# EAGLE design Dashboard r5 (EAGLE 8.5.0)
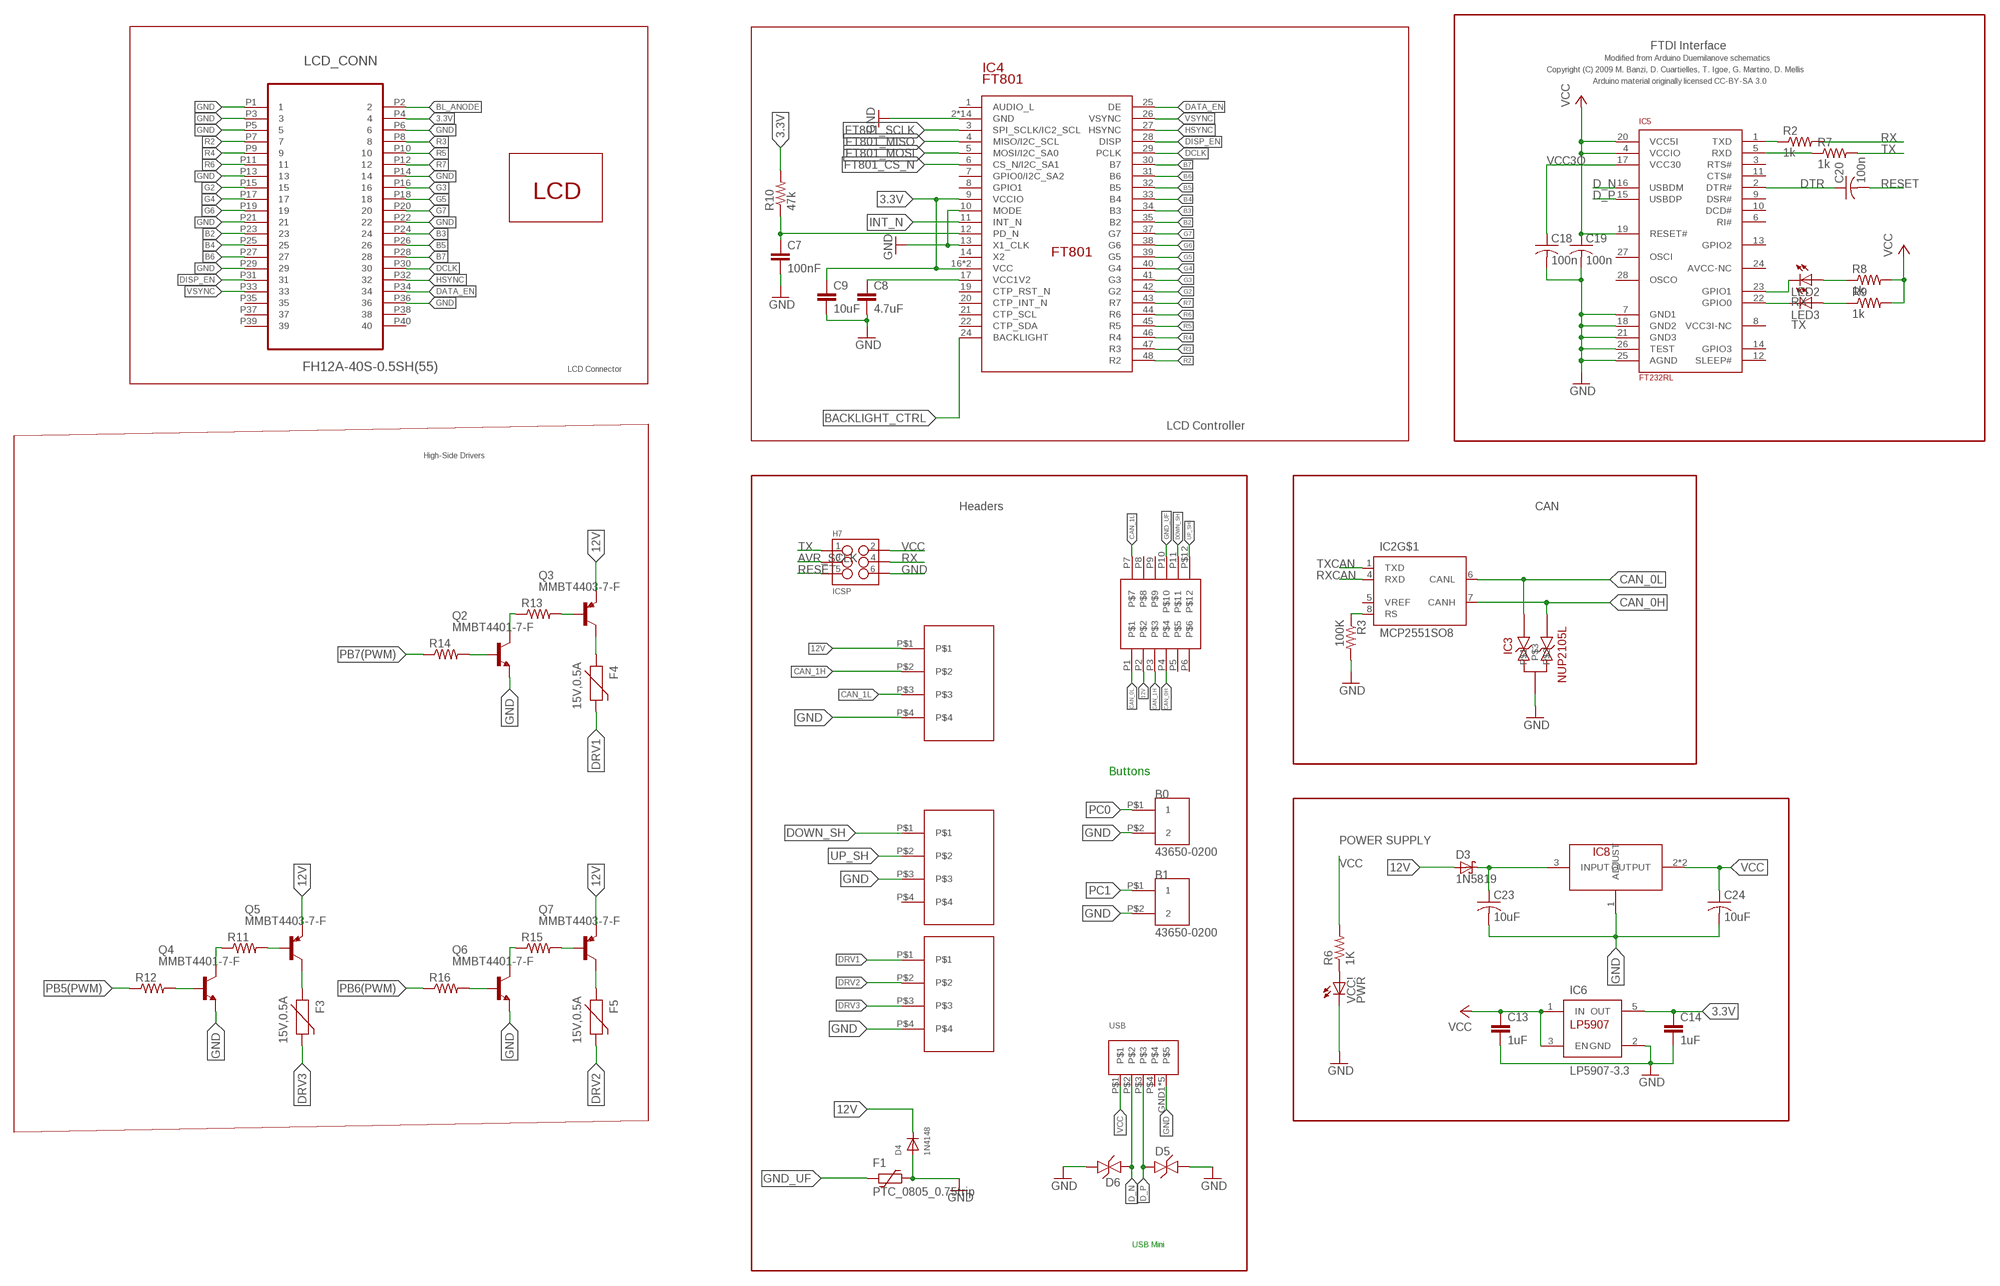
[diagram p0: schematic, sheet 1, part 1 of 2]
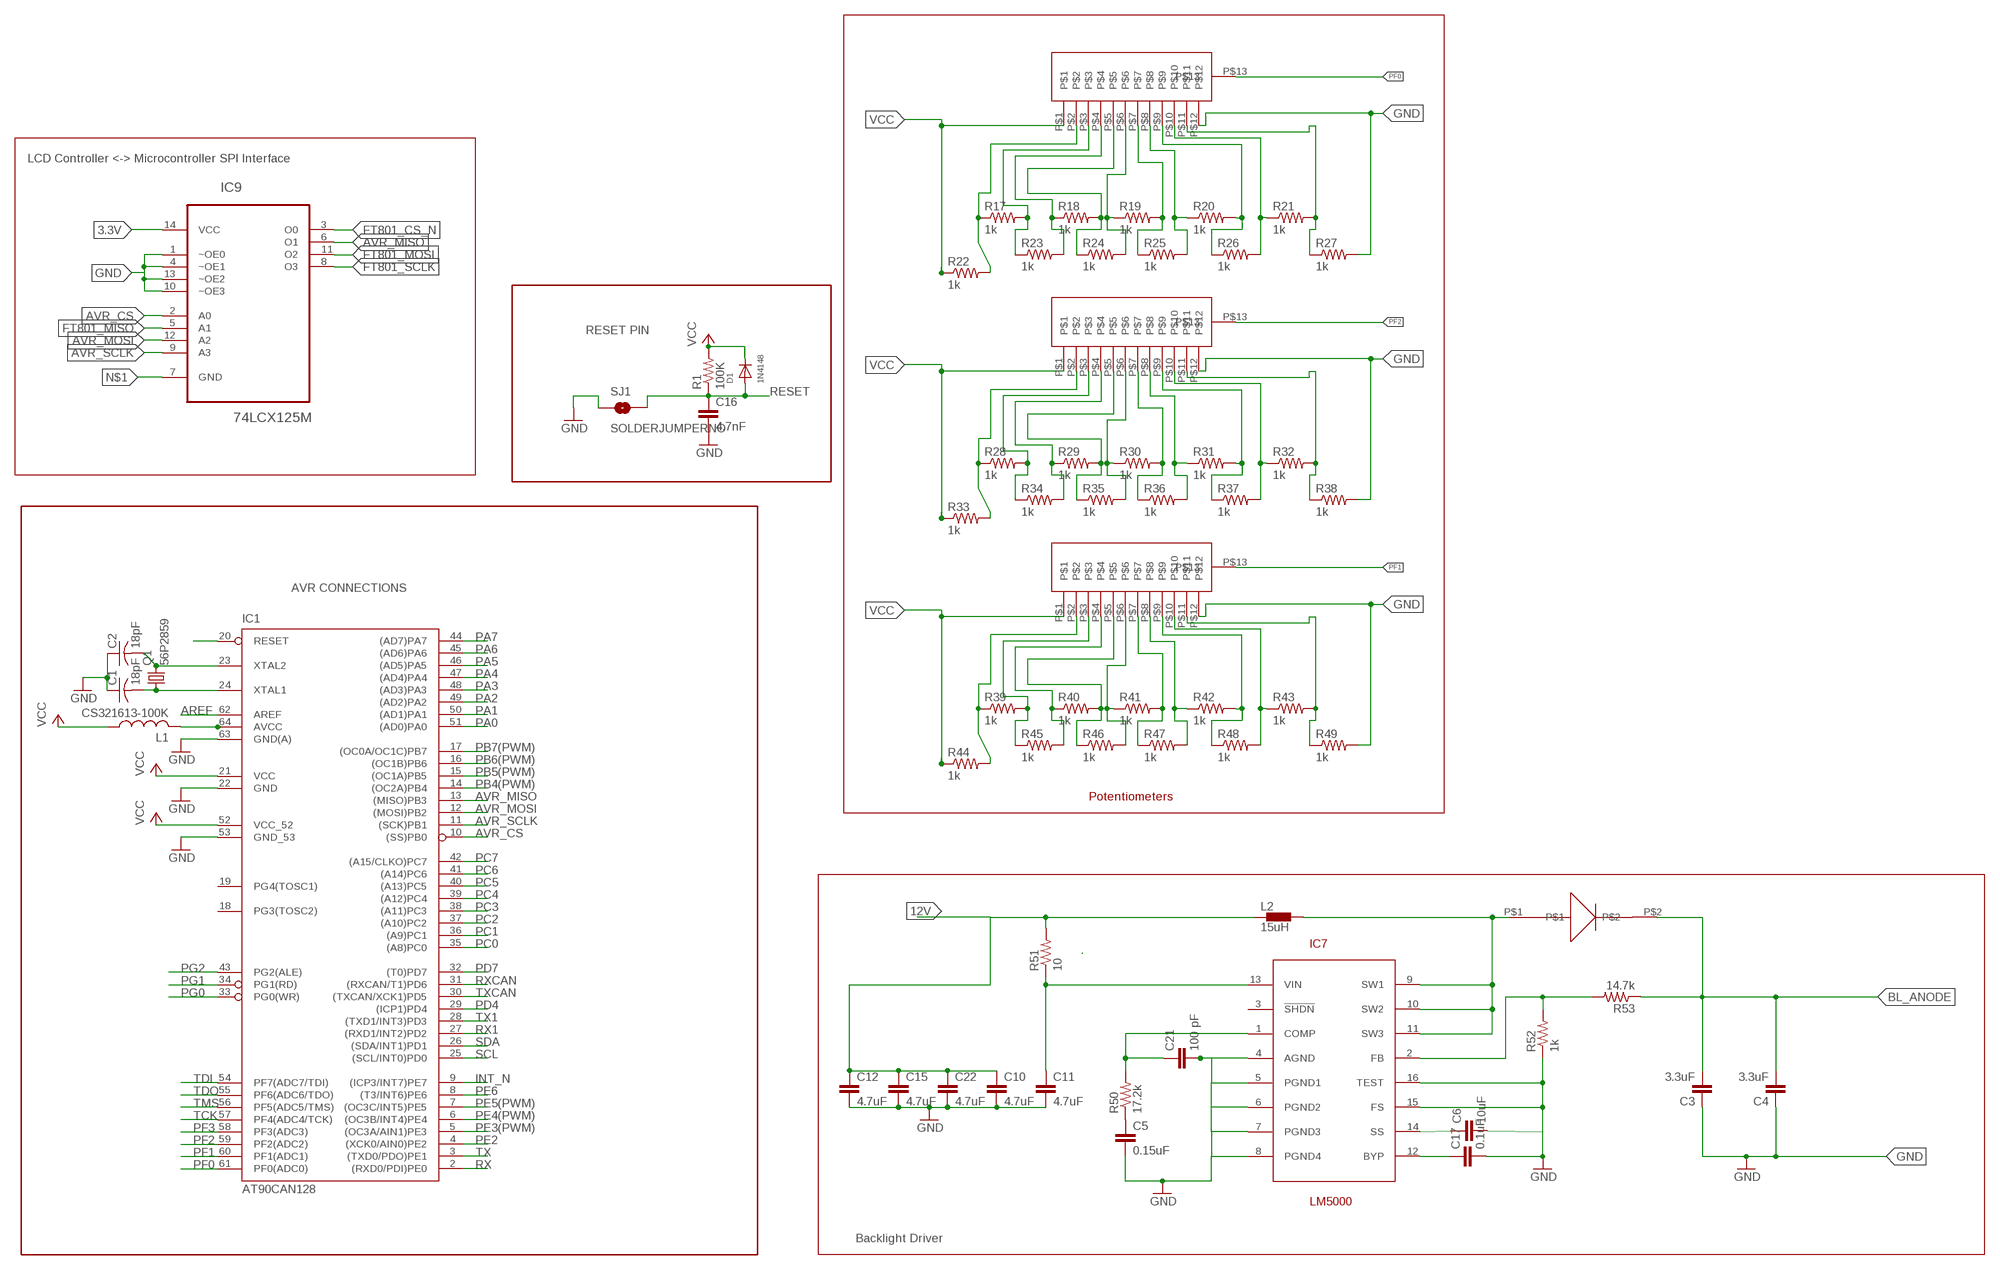
[diagram p1: schematic, sheet 1, part 2 of 2]

## Parts
B0  43650-0200  [MOLEX_43650-0200]
B1  43650-0200  [MOLEX_43650-0200]
C1  18pF  C-USC0805  [C0805]
C2  18pF  C-USC0805  [C0805]
C3  3.3uF  CAP0805  [0805]
C4  3.3uF  CAP0805  [0805]
C5  0.15uF  CAP0805  [0805]
C6  10uF  CAP0805  [0805]
C7  100nF  CAP0603-CAP  [0603-CAP]
C8  4.7uF  CAP0805  [0805]
C9  10uF  CAP0603-CAP  [0603-CAP]
C10  4.7uF  CAP0805  [0805]
C11  4.7uF  CAP0805  [0805]
C12  4.7uF  CAP0805  [0805]
C13  1uF  CAP0603-CAP  [0603-CAP]
C14  1uF  CAP0603-CAP  [0603-CAP]
C15  4.7uF  CAP0805  [0805]
C16  4.7nF  CAP0805  [0805]
C17  0.1uF  CAP0805  [0805]
C18  100n  C-USC0805  [C0805]
C19  100n  C-USC0805  [C0805]
C20  100n  C-USC0805  [C0805]
C21  100 pF  CAP0805  [0805]
C22  4.7uF  CAP0805  [0805]
C23  10uF  C-USC0603  [C0603]
C24  10uF  C-USC0603  [C0603]
CAN1  043650-0409  [043650-0409]
D1  1N4148  DIODESOD-123  [SOD-123]
D2  B160-FDICT_NB  [B160-FDICT-NB]
D3  1N5819  1N5819-BSOD123  [SOD123]
D4  1N4148  DIODESOD-123  [SOD-123]
D5  24VM, 150VC, 0603  TVS_24VM-150VC-0603  [0603]
D6  24VM, 150VC, 0603  TVS_24VM-150VC-0603  [0603]
F1  PTC_0805_0.75trip  PTC_FUSE010/240805L  [0805L]
F3  15V,0.5A  PTCSMD  [PTC-1206]
F4  15V,0.5A  PTCSMD  [PTC-1206]
F5  15V,0.5A  PTCSMD  [PTC-1206]
H7  ICSP  M03X2SMD_FCI  [2X3_SMD_FCI_54202-G30]
IC1  AT90CAN128  [TQFP64]
IC2  MCP2551SO8  [SO08]
IC3  NUP2105L  [SOT-23]
IC4  FT801  [RGZ48_5P15X5P15]
IC5  FT232RL  [SSOP28]
IC6  LP5907-3.3  LP5907  [SOT23-DBV]
IC7  LM5000  [LM5000]
IC8  NCP1117  [SOT-223-4]
IC9  74LCX125M  [SOIC127P600X175-14N]
J2  HR30-7R-12PD(71)  [HR30-7R-12PD(71)]
L1  CS321613-100K  L-USL3216C  [L3216C]
L2  15uH  DEM8045C  [DEM8045C]
LCD  TCG043WQLBAANN-GN00  [TCG043WQLBAANN]
LCD_CONN  FH12A-40S-0.5SH(55)  [HIROSE_FH12A-40S-0.5SH(55)]
LED  043650-0409  [043650-0409]
LED2  RX  LEDCHIPLED_0805  [CHIPLED_0805]
LED3  TX  LEDCHIPLED_0805  [CHIPLED_0805]
Q1  56P2859  CRYSTALSMD  [HC49UP]
Q2  MMBT4401-7-F  [SOT-23-3]
Q3  MMBT4403-7-F  [SOT-23-3]
Q4  MMBT4401-7-F  [SOT-23-3]
Q5  MMBT4403-7-F  [SOT-23-3]
Q6  MMBT4401-7-F  [SOT-23-3]
Q7  MMBT4403-7-F  [SOT-23-3]
R1  100K  R-US_R0805  [R0805]
R2  1k  R-US_R0805  [R0805]
R3  100K  R-US_R0805  [R0805]
R6  1K  R-US_R0805  [R0805]
R7  1k  R-US_R0805  [R0805]
R8  1k  R-US_R0805  [R0805]
R9  1k  R-US_R0805  [R0805]
R10  47k  RESISTOR0603  [0603-RES]
R11  RESISTOR0603  [0603-RES]
R12  RESISTOR0603  [0603-RES]
R13  RESISTOR0603  [0603-RES]
R14  RESISTOR0603  [0603-RES]
R15  RESISTOR0603  [0603-RES]
R16  RESISTOR0603  [0603-RES]
R17  1k  R-US_R0603  [R0603]
R18  1k  R-US_R0603  [R0603]
R19  1k  R-US_R0603  [R0603]
R20  1k  R-US_R0603  [R0603]
R21  1k  R-US_R0603  [R0603]
R22  1k  R-US_R0603  [R0603]
R23  1k  R-US_R0603  [R0603]
R24  1k  R-US_R0603  [R0603]
R25  1k  R-US_R0603  [R0603]
R26  1k  R-US_R0603  [R0603]
R27  1k  R-US_R0603  [R0603]
R28  1k  R-US_R0603  [R0603]
R29  1k  R-US_R0603  [R0603]
R30  1k  R-US_R0603  [R0603]
R31  1k  R-US_R0603  [R0603]
R32  1k  R-US_R0603  [R0603]
R33  1k  R-US_R0603  [R0603]
R34  1k  R-US_R0603  [R0603]
R35  1k  R-US_R0603  [R0603]
R36  1k  R-US_R0603  [R0603]
R37  1k  R-US_R0603  [R0603]
R38  1k  R-US_R0603  [R0603]
R39  1k  R-US_R0603  [R0603]
R40  1k  R-US_R0603  [R0603]
R41  1k  R-US_R0603  [R0603]
R42  1k  R-US_R0603  [R0603]
R43  1k  R-US_R0603  [R0603]
R44  1k  R-US_R0603  [R0603]
R45  1k  R-US_R0603  [R0603]
R46  1k  R-US_R0603  [R0603]
R47  1k  R-US_R0603  [R0603]
R48  1k  R-US_R0603  [R0603]
R49  1k  R-US_R0603  [R0603]
R50  17.2k  RESISTOR0805-RES  [0805]
R51  10  RESISTOR0603  [0603-RES]
R52  1k  RESISTOR0603  [0603-RES]
R53  14.7k  RESISTOR0603  [0603-RES]
S1  ROTSWITCH  [ROTSWITCH]
S2  ROTSWITCH  [ROTSWITCH]
S3  ROTSWITCH  [ROTSWITCH]
SHIFT  043650-0409  [043650-0409]
SJ1  SOLDERJUMPERNO  [SJ_2S-NO]
USB  67503-1020  [MOLEX_67503-1020]
VCC!  PWR  LEDCHIPLED_0805  [CHIPLED_0805]

## Nets
3.3V: C9.1 C14.1 IC4.9(VCCIO) IC4.16(VCC) IC4.18(VCC) IC6.5(OUT) IC9.14(VCC) LCD_CONN.P4 R10.2
5V_REG_IN: C23.1 D3.C IC8.3(INPUT)
12V [Class2]: C10.1 C12.1 C15.1 C22.1 CAN1.P$1 D3.A D4.C J2.P2 L2.P$1 Q3.P$3(E) Q5.P$3(E) Q7.P$3(E) R51.2
AREF: IC1.62(AREF)
AVR_CS: IC1.10((SS)PB0) IC9.2(A0)
AVR_MISO: IC1.13((MISO)PB3) IC9.6(O1)
AVR_MOSI: IC1.12((MOSI)PB2) IC9.12(A2)
AVR_SCLK: H7.3 IC1.11((SCK)PB1) IC9.9(A3)
B2: IC4.35(B2) LCD_CONN.P23
B3: IC4.34(B3) LCD_CONN.P24
B4: IC4.33(B4) LCD_CONN.P25
B5: IC4.32(B5) LCD_CONN.P26
B6: IC4.31(B6) LCD_CONN.P27
B7: IC4.30(B7) LCD_CONN.P28
BACKLIGHT_CTRL: IC4.24(BACKLIGHT)
BL_ANODE [USB]: C3.2 C4.2 D2.P$2 LCD_CONN.P2 R53.1
CAN_0H [USB]: IC2.7(CANH) IC3.2 J2.P4
CAN_0L [USB]: IC2.6(CANL) IC3.1 J2.P1
CAN_1H: CAN1.P$2 J2.P3
CAN_1L: CAN1.P$3 J2.P7
D_N [USB]: D6.1 IC5.16(USBDM) USB.P$2
D_P [USB]: D5.1 IC5.15(USBDP) USB.P$3
DATA_EN: IC4.25(DE) LCD_CONN.P34
DCLK: IC4.29(PCLK) LCD_CONN.P30
DISP_EN: IC4.28(DISP) LCD_CONN.P31
DOWN_SH: J2.P11 SHIFT.P$1
DRV1 [Class3]: F4.2 LED.P$1
DRV2 [Class3]: F5.2 LED.P$2
DRV3 [Class3]: F3.2 LED.P$3
DTR: C20.1 IC5.2(DTR#)
FT801_CS_N: IC4.6(CS_N/I2C_SA1) IC9.3(O0)
FT801_MISO: IC4.4(MISO/I2C_SCL) IC9.5(A1)
FT801_MOSI: IC4.5(MOSI/I2C_SA0) IC9.11(O2)
FT801_SCLK: IC4.3(SPI_SCLK/IC2_SCL) IC9.8(O3)
G2: IC4.42(G2) LCD_CONN.P15
G3: IC4.41(G3) LCD_CONN.P16
G4: IC4.40(G4) LCD_CONN.P17
G5: IC4.39(G5) LCD_CONN.P18
G6: IC4.38(G6) LCD_CONN.P19
G7: IC4.37(G7) LCD_CONN.P20
GND [GND]: B0.P$2 B1.P$2 C1.1 C2.1 C3.1 C4.1 C5.2 C6.2 C7.2 C8.2 C9.2 C10.2 C11.2 C12.2 C13.2 C14.2 C15.2 C16.2 C17.2 C18.2 C19.2 C21.2 C22.2 C23.2 C24.2 CAN1.P$4 D4.A D5.2 D6.2 F1.1 H7.6 IC1.22(GND) IC1.53(GND_53) IC1.63(GND(A)) IC3.3 IC4.2(GND) IC4.10(MODE) IC4.13(X1_CLK) IC4.15(GND) IC4.23(GND) IC4.36(GND) IC4.EP(GND) IC4.V_1(GND) IC4.V_2(GND) IC4.V_3(GND) IC4.V_4(GND) IC4.V_5(GND) IC4.V_6(GND) IC4.V_7(GND) IC4.V_8(GND) IC4.V_9(GND) IC5.7(GND1) IC5.18(GND2) IC5.21(GND3) IC5.25(AGND) IC5.26(TEST) IC6.2(GND) IC7.4(AGND) IC7.5(PGND1) IC7.6(PGND2) IC7.7(PGND3) IC7.8(PGND4) IC7.15(FS) IC7.16(TEST) IC8.1(ADJUST) IC9.1(~OE0) IC9.4(~OE1) IC9.10(~OE3) IC9.13(~OE2) LCD_CONN.P1 LCD_CONN.P3 LCD_CONN.P5 LCD_CONN.P6 LCD_CONN.P13 LCD_CONN.P14 LCD_CONN.P21 LCD_CONN.P22 LCD_CONN.P29 LCD_CONN.P36 LED.P$4 Q2.P$3(E) Q4.P$3(E) Q6.P$3(E) R3.2 R27.2 R38.2 R49.2 R52.1 S1.P$12 S2.P$12 S3.P$12 SHIFT.P$3 SJ1.1 USB.GND1 USB.GND2 USB.GND3 USB.GND4 USB.P$5 VCC!.C
GND_UF: F1.2 J2.P10
HSYNC: IC4.27(HSYNC) LCD_CONN.P32
INT_N: IC1.9((ICP3/INT7)PE7) IC4.11(INT_N)
M8RXD: IC5.1(TXD) R2.1
M8TXD: IC5.5(RXD) R7.1
N$1 [Class2]: IC9.7(GND)
N$2: C8.1 IC4.17(VCC1V2)
N$3: C7.1 IC4.12(PD_N) R10.1
N$4: C5.1 R50.1
N$6: IC2.8(RS) R3.1
N$9: R6.1 VCC!.A
N$11: C1.2 IC1.24(XTAL1) Q1.1
N$22: IC1.64(AVCC) L1.2
N$27 [Class3]: Q4.P$2(B) R12.2
N$28 [Class3]: Q5.P$2(B) R11.2
N$29 [Class3]: Q4.P$1(C) R11.1
N$30 [Class3]: F3.1 Q5.P$1(C)
N$31 [Class3]: Q2.P$2(B) R14.2
N$32: IC5.23(GPIO1) LED2.C
N$33 [Class3]: Q3.P$2(B) R13.2
N$34: IC5.22(GPIO0) LED3.C
N$35: LED2.A R8.1
N$36: LED3.A R9.1
N$37 [Class3]: Q2.P$1(C) R13.1
N$38 [Class3]: F4.1 Q3.P$1(C)
N$39 [Class3]: Q6.P$2(B) R16.2
N$40 [Class3]: Q7.P$2(B) R15.2
N$41 [Class3]: Q6.P$1(C) R15.1
N$42 [Class3]: F5.1 Q7.P$1(C)
N$43: R17.1 R22.2 S1.P$2
N$44: R17.2 R23.1 S1.P$3
N$45: R18.1 R23.2 S1.P$4
N$46: R18.2 R24.1 S1.P$5
N$47: R20.1 R25.2 S1.P$8
N$48: R20.2 R26.1 S1.P$9
N$49: R19.1 R24.2 S1.P$6
N$50: R19.2 R25.1 S1.P$7
N$51: R21.1 R26.2 S1.P$10
N$52: R28.1 R33.2 S2.P$2
N$53: R21.2 R27.1 S1.P$11
N$54: R28.2 R34.1 S2.P$3
N$55: R29.1 R34.2 S2.P$4
N$56: R29.2 R35.1 S2.P$5
N$57: R31.1 R36.2 S2.P$8
N$58: R31.2 R37.1 S2.P$9
N$59: R30.1 R35.2 S2.P$6
N$60: R30.2 R36.1 S2.P$7
N$61: R32.1 R37.2 S2.P$10
N$62: R32.2 R38.1 S2.P$11
N$63: R39.1 R44.2 S3.P$2
N$64: R39.2 R45.1 S3.P$3
N$65: R40.1 R45.2 S3.P$4
N$66: R40.2 R46.1 S3.P$5
N$67: R42.1 R47.2 S3.P$8
N$68: R42.2 R48.1 S3.P$9
N$69: R41.1 R46.2 S3.P$6
N$70: R41.2 R47.1 S3.P$7
N$71: R43.1 R48.2 S3.P$10
N$72: R43.2 R49.1 S3.P$11
N$75: C21.1 IC7.1(COMP) R50.2
N$77: C11.1 IC7.13(VIN) R51.1
N$79: D2.P$1 IC7.9(SW1) IC7.10(SW2) IC7.11(SW3) L2.P$2
N$82: IC7.2(FB) R52.2 R53.2
N$85: C6.1 IC7.14(SS)
N$87: C17.1 IC7.12(BYP)
PA0: IC1.51((AD0)PA0)
PA1: IC1.50((AD1)PA1)
PA2: IC1.49((AD2)PA2)
PA3: IC1.48((AD3)PA3)
PA4: IC1.47((AD4)PA4)
PA5: IC1.46((AD5)PA5)
PA6: IC1.45((AD6)PA6)
PA7: IC1.44((AD7)PA7)
PB4(PWM): IC1.14((OC2A)PB4)
PB5(PWM): IC1.15((OC1A)PB5) R12.1
PB6(PWM): IC1.16((OC1B)PB6) R16.1
PB7(PWM): IC1.17((OC0A/OC1C)PB7) R14.1
PC0: B0.P$1 IC1.35((A8)PC0)
PC1: B1.P$1 IC1.36((A9)PC1)
PC2: IC1.37((A10)PC2)
PC3: IC1.38((A11)PC3)
PC4: IC1.39((A12)PC4)
PC5: IC1.40((A13)PC5)
PC6: IC1.41((A14)PC6)
PC7: IC1.42((A15/CLKO)PC7)
PD4: IC1.29((ICP1)PD4)
PD7: IC1.32((T0)PD7)
PE2: IC1.4((XCK0/AIN0)PE2)
PE3(PWM): IC1.5((OC3A/AIN1)PE3)
PE4(PWM): IC1.6((OC3B/INT4)PE4)
PE5(PWM): IC1.7((OC3C/INT5)PE5)
PE6: IC1.8((T3/INT6)PE6)
PF0: IC1.61(PF0(ADC0)) S1.P$13
PF1: IC1.60(PF1(ADC1)) S3.P$13
PF2: IC1.59(PF2(ADC2)) S2.P$13
PF3: IC1.58(PF3(ADC3))
PG0: IC1.33(PG0(WR))
PG1: IC1.34(PG1(RD))
PG2: IC1.43(PG2(ALE))
R2: IC4.48(R2) LCD_CONN.P7
R3: IC4.47(R3) LCD_CONN.P8
R4: IC4.46(R4) LCD_CONN.P9
R5: IC4.45(R5) LCD_CONN.P10
R6: IC4.44(R6) LCD_CONN.P11
R7: IC4.43(R7) LCD_CONN.P12
RESET [USB]: C16.1 C20.2 D1.A H7.5 IC1.20(RESET) R1.1 SJ1.2
RX: H7.4 IC1.2((RXD0/PDI)PE0) R2.2
RX1: IC1.27((RXD1/INT2)PD2)
RXCAN: IC1.31((RXCAN/T1)PD6) IC2.4(RXD)
SCL: IC1.25((SCL/INT0)PD0)
SDA: IC1.26((SDA/INT1)PD1)
TCK: IC1.57(PF4(ADC4/TCK))
TDI: IC1.54(PF7(ADC7/TDI))
TDO: IC1.55(PF6(ADC6/TDO))
TMS: IC1.56(PF5(ADC5/TMS))
TX: H7.1 IC1.3((TXD0/PDO)PE1) R7.2
TX1: IC1.28((TXD1/INT3)PD3)
TXCAN: IC1.30((TXCAN/XCK1)PD5) IC2.1(TXD)
UP_SH [GND]: J2.P$12 SHIFT.P$2
VCC [USB]: C13.1 C19.1 C24.1 D1.C H7.2 IC1.21(VCC) IC1.52(VCC_52) IC5.4(VCCIO) IC5.19(RESET#) IC5.20(VCC5I) IC6.1(IN) IC6.3(EN) IC8.2(OUTPUT) IC8.4(OUTPUT) L1.1 R1.2 R6.2 R8.2 R9.2 R22.1 R33.1 R44.1 S1.P$1 S2.P$1 S3.P$1 USB.P$1
VCC3O: C18.1 IC5.17(VCC30)
VSYNC: IC4.26(VSYNC) LCD_CONN.P33
XTAL1: C2.2 IC1.23(XTAL2) Q1.2
Unconnected: IC1.18(PG3(TOSC2)) IC1.19(PG4(TOSC1)) IC2.5(VREF) IC4.1(AUDIO_L) IC4.7(GPIO0/I2C_SA2) IC4.8(GPIO1) IC4.14(X2) IC4.19(CTP_RST_N) IC4.20(CTP_INT_N) IC4.21(CTP_SCL) IC4.22(CTP_SDA) IC5.3(RTS#) IC5.6(RI#) IC5.8(VCC3I-NC) IC5.9(DSR#) IC5.10(DCD#) IC5.11(CTS#) IC5.12(SLEEP#) IC5.13(GPIO2) IC5.14(GPIO3) IC5.24(AVCC-NC) IC5.27(OSCI) IC5.28(OSCO) IC7.3(!SHDN) J2.P5 J2.P6 J2.P8 J2.P9 LCD_CONN.P35 LCD_CONN.P37 LCD_CONN.P38 LCD_CONN.P39 LCD_CONN.P40 SHIFT.P$4 USB.P$4

## Notes on the sheet
- LCD Controller <-> Microcontroller SPI Interface
- FTDI Interface
- Modified from Arduino Duemilanove schematics
- Copyright (C) 2009 M. Banzi, D. Cuartielles, T. Igoe, G. Martino, D. Mellis
- Arduino material originally licensed CC-BY-SA 3.0
- RESET PIN
- AVR CONNECTIONS
- LCD Connector
- LCD Controller
- High-Side Drivers
- Headers | CAN
- Potentiometers
- Buttons
- POWER SUPPLY
- Backlight Driver
- USB Mini

## Power pins joined to a net without a drawn wire
GND: IC2.2(GND)
VCC: IC2.3(VCC)

## Library data of the parts
B0 B1 = molex:43650-0200
C1 C2 C18-C20 = rcl:C-US: CAPACITOR, American symbol; SPICEPREFIX: C
C3-C8 C10-C17 C21 C22 = SparkFun-Capacitors:CAP: Capacitor Standard 0603 ceramic capacitor, and 0.1" leaded capacitor.
C9 = SparkFun-Passives:CAP: Capacitor Standard 0603 ceramic capacitor, and 0.1" leaded capacitor.
C23 C24 = rcl:C-US: CAPACITOR, American symbol
CAN1 LED SHIFT = molex:043650-0409
D1 D4 = adafruit:DIODE: Diode SMADIODE - SMA Surface Mount Package 20V 1A Schottky Diode Digikey: 641-1014-6-ND DO-1N4148 - Through Hole Small Current Diode SOD-123 20V 1 A (.5mV Vf) Schottky Diode - Digikey: MBRX120TPMSCT-ND SOD-323 10V 570mA (.38mV Vf, 3ns) Schottky Diode - Digikey: ZLLS410CT-ND SOD-523 30V 30mA Schottky Diode (RB751S-40TE61) - Digikey: RB751S-40TE61CT-ND SOT23-R/W - SOT23 Package (R = Solder Paste/Reflow Ovens, W = Hand-Soldering) BAT54Film 40V 300mA - Digikey: 497-7162-1-ND
D2 = diodes-inc-e14:B160-FDICT_NB
D3 = diode:1N581*: 1.0A SCHOTTKY BARRIER RECTIFIER Source: http://www.diodes.com/datasheets/ds23001.pdf
D5 D6 = texas-boosterpack:TVS_; CCO: 130-0001371; DESCRIPTION: TVS DIODE 24VWM 150VC 0603; MAN: LITTLEFUSE
F1 = LittleFuse:PTC_FUSE: Polyfuse Resettable PTC Source: http://www.littelfuse.com/products/resettable-ptcs.aspx; MF: Littelfuse; MPN: 0805L010/24; OC_FARNELL: unknown; OC_NEWARK: 23X4297
F3-F5 = SparkFun:PTC: Resettable Fuse PTC Resettable Fuse. Spark Fun Electronics SKU : COM-08357
H7 = SparkFun-Connectors:M03X2: 2x3 .1" header. Shrouded, with keying- CONN-10681 SMT- CONN-11415 Pogo pins- HW-11044
IC1 = at90can128:AT90CAN128
IC2 = can:MCP2551: CAN Tranceiver Microchip
IC3 = Artificial Science:NUP2105L
IC4 = ftdichip:FT801: IC TFT LCD CONTROLLER 48VQFN
IC5 = SmartPrj:FT232RL
IC6 = texas:LP5907
IC7 = texas:LM5000
IC8 = on-semiconductor:NCP1117
IC9 = Fairchild_By_element14_Batch_1:74LCX125M: Low Voltage Quad Buffer with 5V Tolerant Inputs and Outputs; MPN: 74LCX125M; OC_FARNELL: 1013776; OC_NEWARK: 78K6286; PACKAGE: SOIC-14; SUPPLIER: Fairchild
J2 = hisense:HR30-7R-12PD(71)
L1 = rcl:L-US: INDUCTOR, American symbol; SPICEPREFIX: L
L2 = inductors:DEM8045C
LCD = kyocera:TCG043WQLBAANN-GN00
LCD_CONN = hirose:FH12A-40S-0.5SH(55): SOCKET FFC/FPC, ZIF, 0.5MM, 40WAY; MPN: FH12A-40S-0.5SH(55); OC_FARNELL: 1324569; OC_NEWARK: 34M6194; PACKAGE: SOCKET FFC/FPC, ZIF, 0.5MM, 40WAY; SUPPLIER: Hirose
LED2 LED3 VCC! = led:LED: LED OSRAM: - CHIPLED LG R971, LG N971, LY N971, LG Q971, LY Q971, LO R971, LY R971 LH N974, LH R974 LS Q976, LO Q976, LY Q976 LO Q996 - Hyper CHIPLED LW Q18S LB Q993, LB Q99A, LB R99A - SideLED LS A670, LO A670, LY A670, LG A670, LP A670 LB A673, LV A673, LT A673, LW A673 LH A674 LY A675 LS A676, LA A676, LO A676, LY A676, LW A676 LS A679, LY A679, LG A679 - Hyper Micro SIDELED® LS Y876, LA Y876, LO Y876, LY Y876 LT Y87S - SmartLED LW L88C, LW L88S LB L89C, LB L89S, LG L890 LS L89K, LO L89K, LY L89K LS L896, LA L896, LO L896, LY L896 - TOPLED LS T670, LO T670, LY T670, LG T670, LP T670 LSG T670, LSP T670, LSY T670, LOP T670, LYG T670 LG T671, LOG T671, LSG T671 LB T673, LV T673, LT T673, LW T673 LH T674 LS T676, LA T676, LO T676, LY T676, LB T676, LH T676, LSB T676, LW T676 LB T67C, LV T67C, LT T67C, LS T67K, LO T67K, LY T67K, LW E67C LS E67B, LA E67B, LO E67B, LY E67B, LB E67C, LV E67C, LT E67C LW T67C LS T679, LY T679, LG T679 LS T770, LO T770, LY T770, LG T770, LP T770 LB T773, LV T773, LT T773, LW T773 LH T774 LS E675, LA E675, LY E675, LS T675 LS T776, LA T776, LO T776, LY T776, LB T776 LHGB T686 LT T68C, LB T68C - Hyper Mini TOPLED® LB M676 - Mini TOPLED Santana® LG M470 LS M47K, LO M47K, LY M47K Source: http://www.osram.convergy.de LUXEON: - LUMILED® LXK2-PW12-R00, LXK2-PW12-S00, LXK2-PW14-U00, LXK2-PW14-V00 LXK2-PM12-R00, LXK2-PM12-S00, LXK2-PM14-U00 LXK2-PE12-Q00, LXK2-PE12-R00, LXK2-PE12-S00, LXK2-PE14-T00, LXK2-PE14-U00 LXK2-PB12-K00, LXK2-PB12-L00, LXK2-PB12-M00, LXK2-PB14-N00, LXK2-PB14-P00, LXK2-PB14-Q00 LXK2-PR12-L00, LXK2-PR12-M00, LXK2-PR14-Q00, LXK2-PR14-R00 LXK2-PD12-Q00, LXK2-PD12-R00, LXK2-PD12-S00 LXK2-PH12-R00, LXK2-PH12-S00 LXK2-PL12-P00, LXK2-PL12-Q00, LXK2-PL12-R00 Source: www.luxeon.com KINGBRIGHT: KA-3528ASYC Source: www.kingbright.com
Q1 = SparkFun-FreqCtrl:CRYSTAL: Various standard crystals. Proven footprints. Spark Fun Electronics SKU : COM-00534
Q2 Q4 Q6 = formula electric:MMBT4401-7-F
Q3 Q5 Q7 = formula electric:MMBT4403-7-F
R1-R3 R6-R9 = rcl:R-US_: RESISTOR, American symbol; SPICEPREFIX: R
R10-R16 R51-R53 = SparkFun-Resistors:RESISTOR: Resistor Basic schematic elements and footprints for 0603, 1206, and PTH resistors.
R17-R49 = rcl:R-US_: RESISTOR, American symbol
R50 = SparkFun-Passives:RESISTOR: Resistor Basic schematic elements and footprints for 0603, 1206, and PTH resistors.
S1-S3 = DashAndCAN library:ROTSWITCH
SJ1 = SparkFun-Passives:SOLDERJUMPER: Solder Jumper Standard SMD solder jumper. Used to automate production. Two varients : Normally Open and Normally Closed are the same, but have different paste layers. NC will have a large amount of paste and should jumper during reflow.
USB = molex:67503-1020: USB On-The-Go (OTG) Mini-B Receptacle, Surface Mount, Right Angle, Solder Tabs with Back Cover and PCB Locator Plastic Pegs, Lead-Free

## Net classes
1 USB: width 0.366 mm, clearance 0.152 mm to class 0, clearance 0.152 mm
2 Class2: width 0.635 mm, clearance 0.178 mm
3 Class3: width 0.559 mm
4 GND: width 0.406 mm

## Board
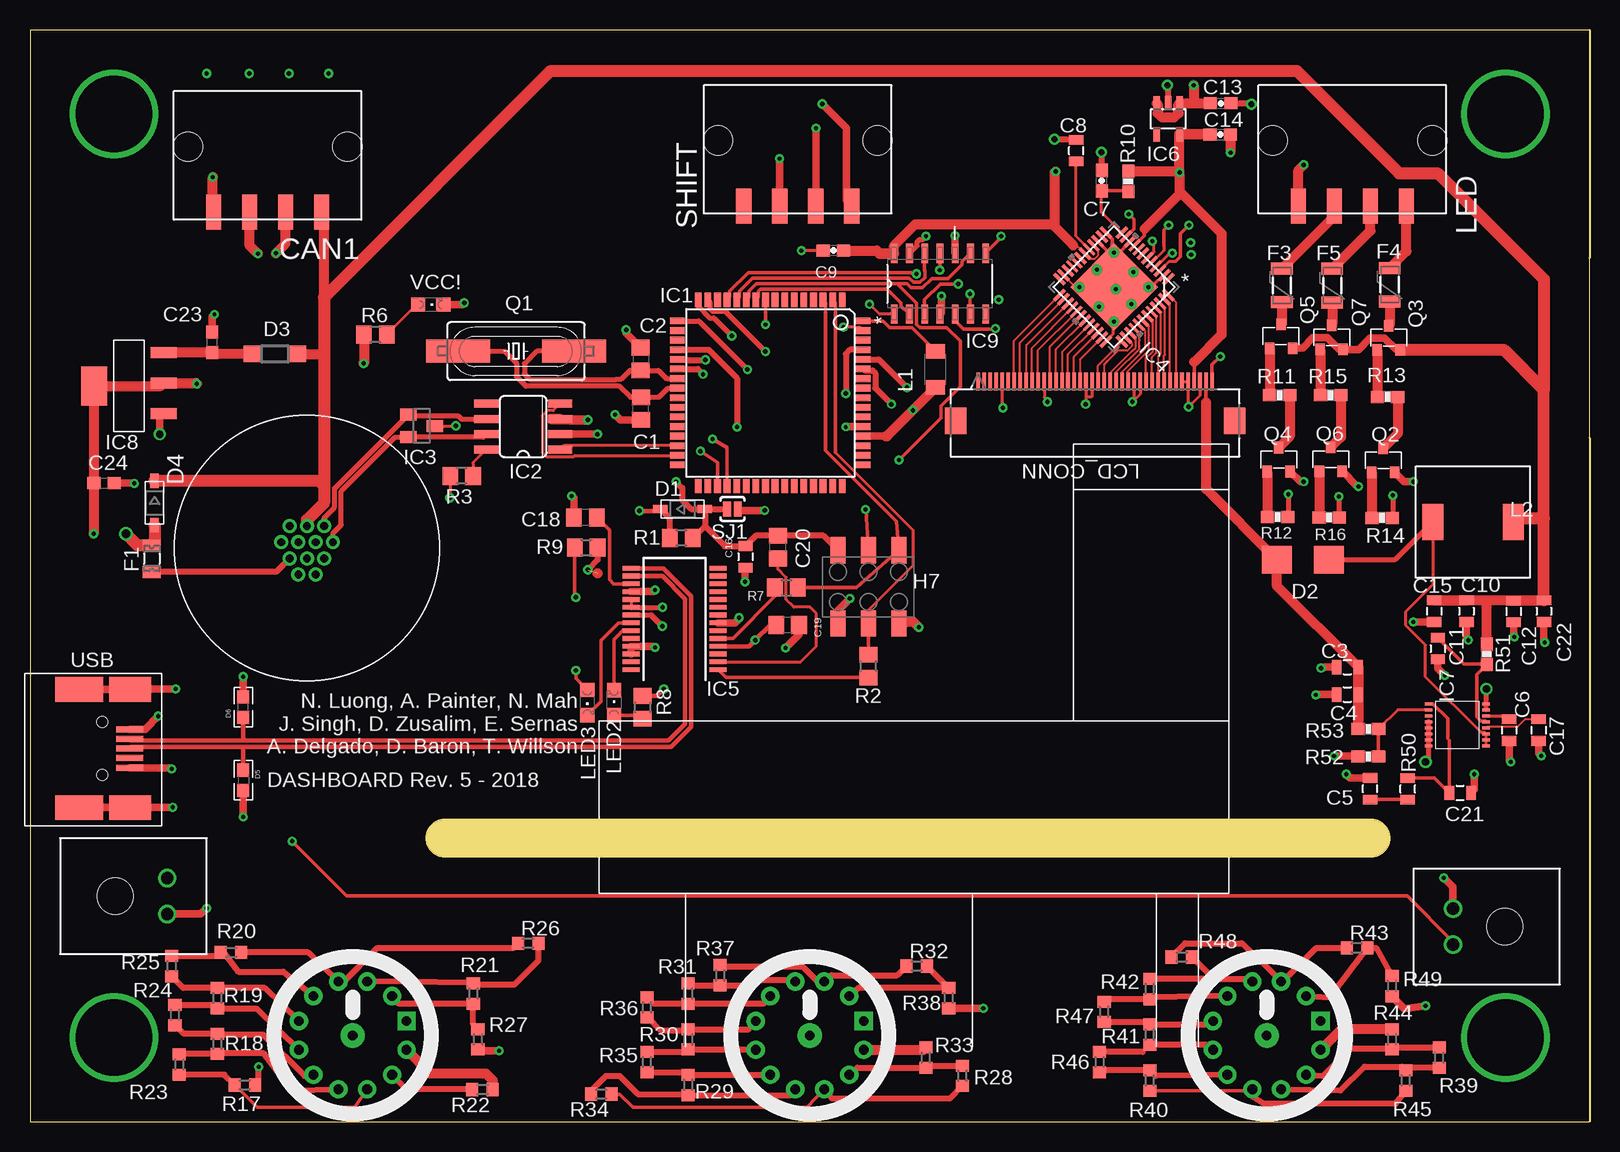
[diagram p2: board, top side]
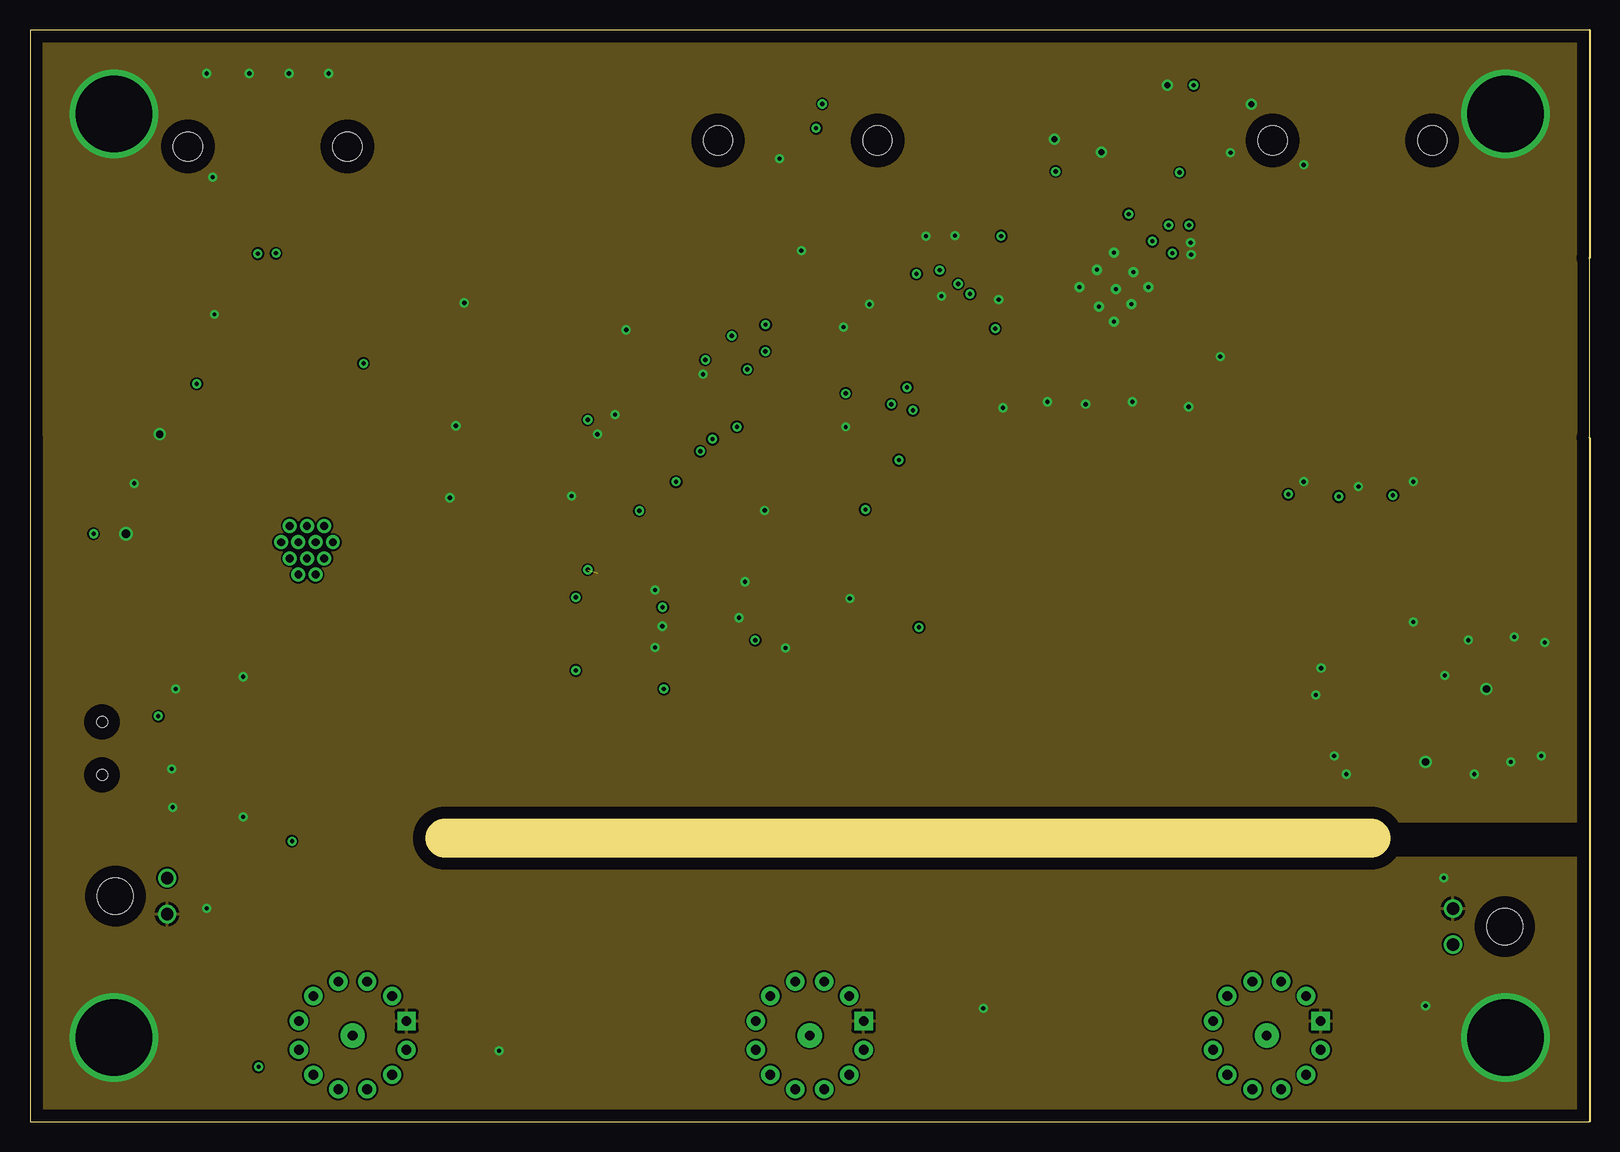
[diagram p3: board, inner layer Route6]
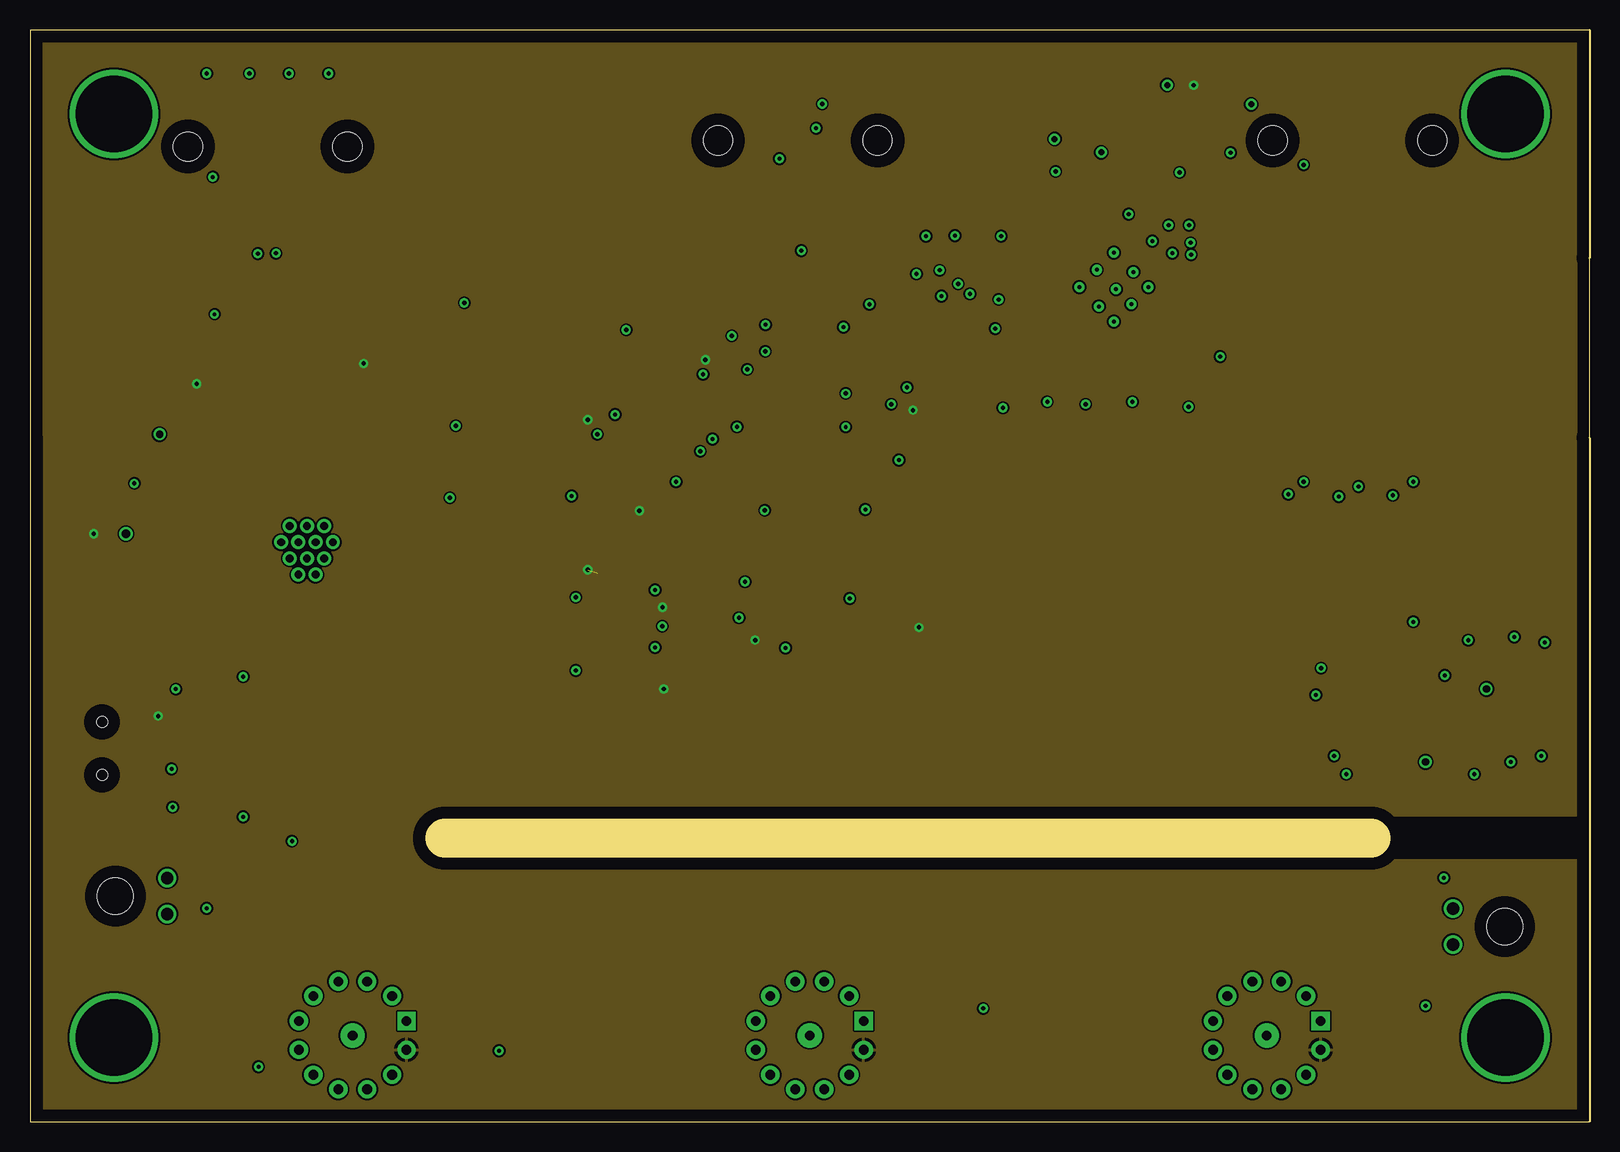
[diagram p4: board, inner layer Route11]
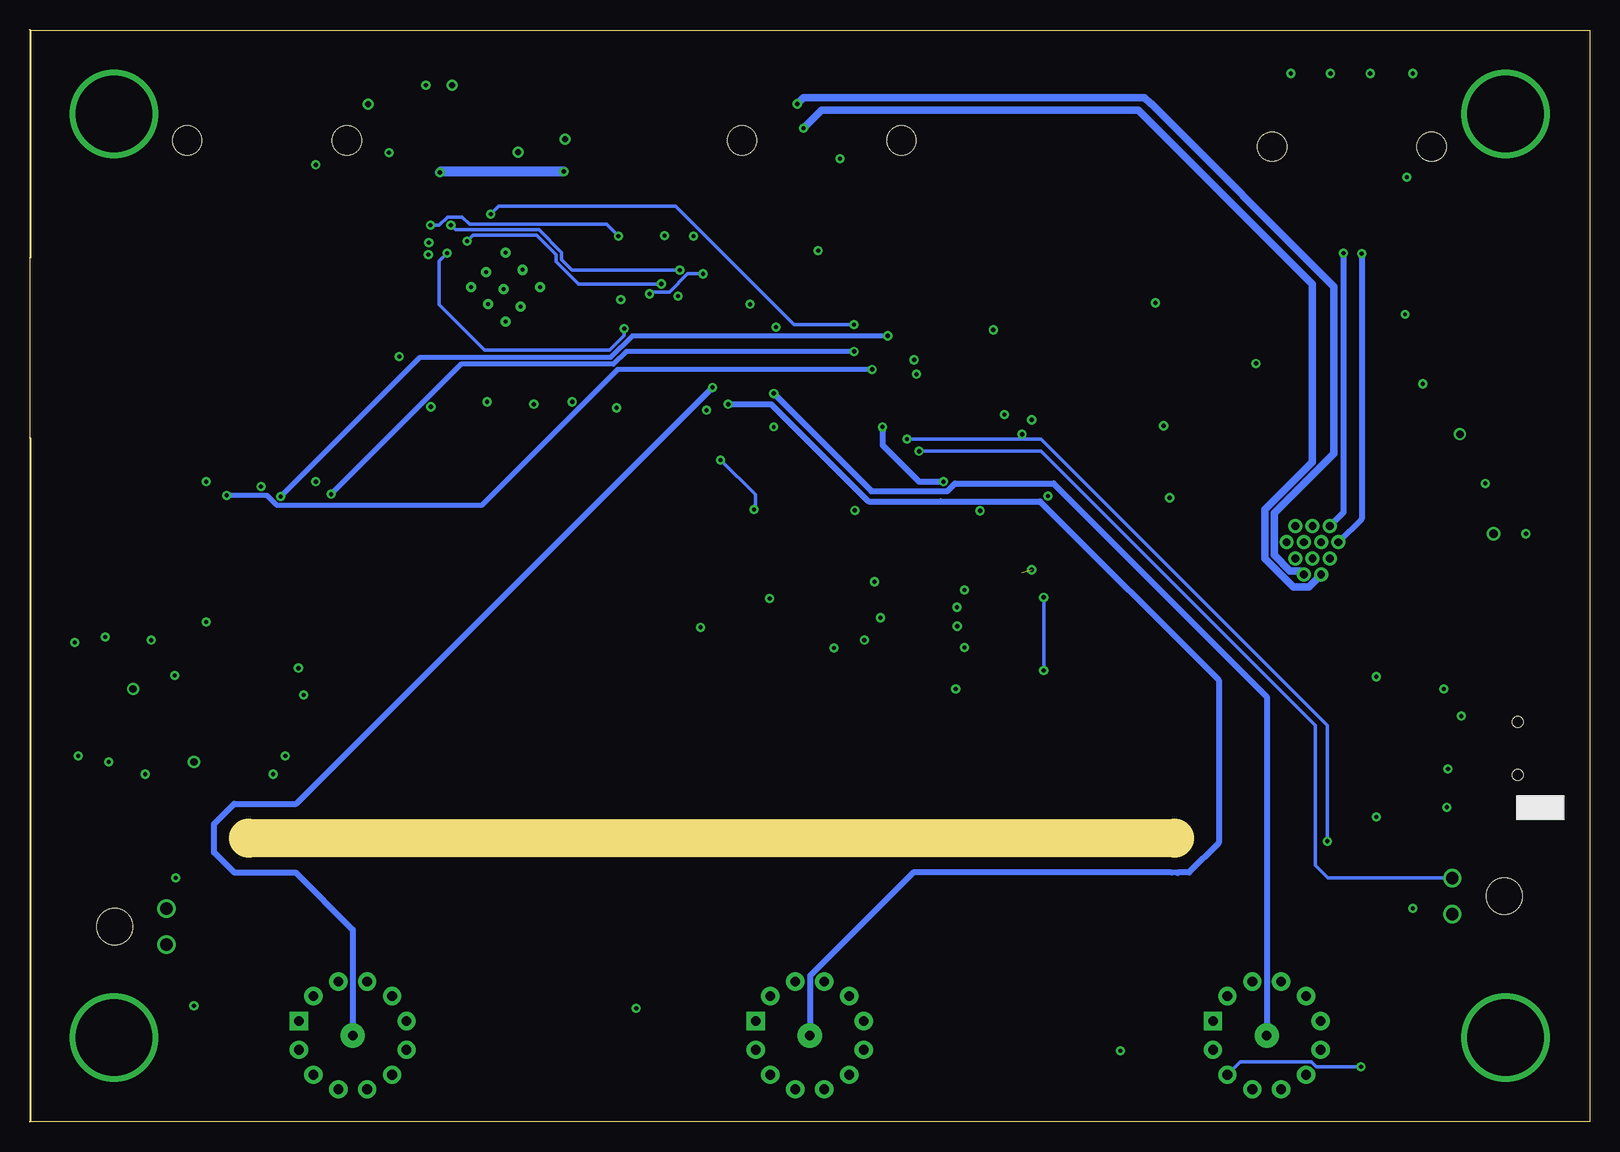
[diagram p5: board, bottom side, seen from below]

Size 130 x 91 mm. Coordinates in mm from the lower left corner, seen from the top.
Outline: 0,0 130,0
Outline: 130,91 0,91 0,0
Outline: 0,57 0,0
Outline: 130,91 130,72
Outline: 130,57 130,0
Outline: 130,0 130,91
Outline: 34.8,22.1 111.76,22.1 111.76,25.15 34.54,25.15 34.8,22.1
Outline: circle at 34.57,23.62 radius 1.52
Outline: circle at 111.79,23.62 radius 1.52
Copper layers (1*6*11*16): Top 0.053340625mm / dielectric 7.5mil / Route6 0.035559375mm / dielectric 40mil / Route11 0.035559375mm / dielectric 7.5mil / Bottom 0.053340625mm
Design rules "default *": minimum track width 4mil, minimum drill 0.35mm, track to track 6mil, track to pad 6mil, pad to pad 6mil, via to via 6mil, smd to smd 6mil, copper to edge 40mil, drill to drill 5mil, minimum pad ring 10mil, minimum via ring 8mil, stop-mask expansion 4mil, vias tented up to drill 0mil, thermal gap 10mil
tKeepout: area 38,36.5 to 48,46.5; area 82,36.5 to 92,46.5; area 92.8,71.8 to 100.8,79.8; area 80,71.8 to 88,79.8; area 29.2,71.8 to 37.2,79.8; area 42,71.8 to 50,79.8
tRestrict: area 85.1,71 to 85.5,71.3; area 87.9,73.9 to 90,75.1
Milling: 2 lines

### Footprints (pad centres in the part's own frame; a part is rotated, then mirrored left to right if it is on the bottom)
MOLEX_43650-0200 = drill 1.02: P$1 -1.5,4.32; P$2 1.5,4.32 | hole 3: 0,0
C0805 = smd 1.3 x 1.5: 1 -0.95,0; 2 0.95,0
0805 = smd 0.8 x 1.2: 1 -0.9,0; 2 0.9,0
0603-CAP = smd 1.1 x 1: 1 -0.85,0; 2 0.85,0
C0603 = smd 1.1 x 1: 1 -0.85,0; 2 0.85,0
043650-0409 = smd 1.27 x 2.92: P$1 -4.5,5.47; P$2 -1.5,5.47; P$3 1.5,5.47; P$4 4.5,5.47 | hole 2.41: -6.65,0; 6.65,0
SOD-123 = smd 1.2 x 0.7: A 1.85,0; C -1.85,0
B160-FDICT-NB = smd 2.5 x 2.3: P$1 -2.15,0; P$2 2.15,0
SOD123 = smd 1.4 x 1.4: A 1.9,0; C -1.9,0
0603 = smd 1.1 x 1: 1 -0.85,0; 2 0.85,0
0805L = smd 1 x 1.5: 1 -1.1,0; 2 1.1,0
PTC-1206 = smd 1 x 1.8: 1 -1.4,0; 2 1.4,0
2X3_SMD_FCI_54202-G30 = smd 1.27 x 2.18: 1 -2.54,-3.05; 2 -2.54,3.05; 3 0,-3.05; 4 0,3.05; 5 2.54,-3.05; 6 2.54,3.05
TQFP64 = smd 1.194 x 0.559: 1 -7.76,6; 2 -7.76,5.2; 3 -7.76,4.4; 4 -7.76,3.6; 5 -7.76,2.8; 6 -7.76,2; 7 -7.76,1.2; 8 -7.76,0.4; 9 -7.76,-0.4; 10 -7.76,-1.2; 11 -7.76,-2; 12 -7.76,-2.8; 13 -7.76,-3.6; 14 -7.76,-4.4; 15 -7.76,-5.2; 16 -7.76,-6; 33 7.76,-6; 34 7.76,-5.2; 35 7.76,-4.4; 36 7.76,-3.6; 37 7.76,-2.8; 38 7.76,-2; 39 7.76,-1.2; 40 7.76,-0.4; 41 7.76,0.4; 42 7.76,1.2; 43 7.76,2; 44 7.76,2.8; 45 7.76,3.6; 46 7.76,4.4; 47 7.76,5.2; 48 7.76,6 | smd 0.559 x 1.194: 17 -6,-7.76; 18 -5.2,-7.76; 19 -4.4,-7.76; 20 -3.6,-7.76; 21 -2.8,-7.76; 22 -2,-7.76; 23 -1.2,-7.76; 24 -0.4,-7.76; 25 0.4,-7.76; 26 1.2,-7.76; 27 2,-7.76; 28 2.8,-7.76; 29 3.6,-7.76; 30 4.4,-7.76; 31 5.2,-7.76; 32 6,-7.76; 49 6,7.76; 50 5.2,7.76; 51 4.4,7.76; 52 3.6,7.76; 53 2.8,7.76; 54 2,7.76; 55 1.2,7.76; 56 0.4,7.76; 57 -0.4,7.76; 58 -1.2,7.76; 59 -2,7.76; 60 -2.8,7.76; 61 -3.6,7.76; 62 -4.4,7.76; 63 -5.2,7.76; 64 -6,7.76
SO08 = smd 0.66 x 2.032: 1 -1.905,-3.073; 2 -0.635,-3.073; 3 0.635,-3.073; 4 1.905,-3.073; 5 1.905,3.073; 6 0.635,3.073; 7 -0.635,3.073; 8 -1.905,3.073
SOT-23 = smd 1 x 1.4: 1 -0.95,-1.1; 2 0.95,-1.1; 3 0,1.1
RGZ48_5P15X5P15 = smd 1.245 x 0.279: 1 -3.683,2.743; 2 -3.683,2.261; 3 -3.683,1.753; 4 -3.683,1.245; 5 -3.683,0.762; 6 -3.683,0.254; 7 -3.683,-0.254; 8 -3.683,-0.762; 9 -3.683,-1.245; 10 -3.683,-1.753; 11 -3.683,-2.261; 12 -3.683,-2.743; 25 3.683,-2.743; 26 3.683,-2.261; 27 3.683,-1.753; 28 3.683,-1.245; 29 3.683,-0.762; 30 3.683,-0.254; 31 3.683,0.254; 32 3.683,0.762; 33 3.683,1.245; 34 3.683,1.753; 35 3.683,2.261; 36 3.683,2.743 | smd 0.279 x 1.245: 13 -2.743,-3.683; 14 -2.261,-3.683; 15 -1.753,-3.683; 16 -1.245,-3.683; 17 -0.762,-3.683; 18 -0.254,-3.683; 19 0.254,-3.683; 20 0.762,-3.683; 21 1.245,-3.683; 22 1.753,-3.683; 23 2.261,-3.683; 24 2.743,-3.683; 37 2.743,3.683; 38 2.261,3.683; 39 1.753,3.683; 40 1.245,3.683; 41 0.762,3.683; 42 0.254,3.683; 43 -0.254,3.683; 44 -0.762,3.683; 45 -1.245,3.683; 46 -1.753,3.683; 47 -2.261,3.683; 48 -2.743,3.683 | smd 5.156 x 5.156: EP 0,0 | drill 0.33: V_1 -2.032,2.032; V_2 0,2.032; V_3 2.032,2.032; V_4 -2.032,0.254; V_5 0,0.254; V_6 2.032,0.254; V_7 -2.032,-2.032; V_8 0,-2.032; V_9 2.032,-2.032
SSOP28 = smd 0.381 x 1.499: 1 -4.225,-3.625; 2 -3.575,-3.625; 3 -2.925,-3.625; 4 -2.275,-3.625; 5 -1.625,-3.625; 6 -0.975,-3.625; 7 -0.325,-3.625; 8 0.325,-3.625; 9 0.975,-3.625; 10 1.625,-3.625; 11 2.275,-3.625; 12 2.925,-3.625; 13 3.575,-3.625; 14 4.225,-3.625; 15 4.225,3.625; 16 3.575,3.625; 17 2.925,3.625; 18 2.275,3.625; 19 1.625,3.625; 20 0.975,3.625; 21 0.325,3.625; 22 -0.325,3.625; 23 -0.975,3.625; 24 -1.625,3.625; 25 -2.275,3.625; 26 -2.925,3.625; 27 -3.575,3.625; 28 -4.225,3.625
SOT23-DBV = smd 0.55 x 1.2: 1 -0.95,-1.3; 2 0,-1.3; 3 0.95,-1.3; 4 0.95,1.3; 5 -0.95,1.3
LM5000 = smd 0.6 x 0.25: 1 -2.4,1.75; 2 -2.4,1.25; 3 -2.4,0.75; 4 -2.4,0.25; 5 -2.4,-0.25; 6 -2.4,-0.75; 7 -2.4,-1.25; 8 -2.4,-1.75; 9 2.4,-1.75; 10 2.4,-1.25; 11 2.4,-0.75; 12 2.4,-0.25; 13 2.4,0.25; 14 2.4,0.75; 15 2.4,1.25; 16 2.4,1.75
SOT-223-4 = smd 0.95 x 2.15: 1 -2.3,-2.9; 2 0.24,-2.9; 3 2.78,-2.9 | smd 3.25 x 2.15: 4 0,2.9
SOIC127P600X175-14N = smd 1.6 x 0.559: 1 -2.54,3.81; 2 -2.54,2.54; 3 -2.54,1.27; 4 -2.54,0; 5 -2.54,-1.27; 6 -2.54,-2.54; 7 -2.54,-3.81; 8 2.54,-3.81; 9 2.54,-2.54; 10 2.54,-1.27; 11 2.54,0; 12 2.54,1.27; 13 2.54,2.54; 14 2.54,3.81
HR30-7R-12PD(71) = drill 0.65 pad 1.016: P1 1.44,1.83; P2 0,1.83; P3 -1.44,1.83; P4 2.16,0.48; P5 0.72,0.48; P6 -0.72,0.48; P7 -2.16,0.48; P8 1.44,-0.87; P9 0,-0.87; P10 -1.44,-0.87; P11 0.72,-2.22; P$12 -0.72,-2.22
L3216C = smd 1.2 x 1.6: 1 -1.5,0; 2 1.5,0
DEM8045C = smd 1.75 x 3: P$1 0.875,4.15; P$2 7.6,4.15
HIROSE_FH12A-40S-0.5SH(55) = smd 1.803 x 2.21: 41 -11.633,6.68; 42 11.633,6.68 | smd 0.305 x 1.499: P1 -9.754,3.429; P2 -9.246,3.429; P3 -8.738,3.429; P4 -8.255,3.429; P5 -7.747,3.429; P6 -7.239,3.429; P7 -6.756,3.429; P8 -6.248,3.429; P9 -5.74,3.429; P10 -5.258,3.429; P11 -4.75,3.429; P12 -4.242,3.429; P13 -3.759,3.429; P14 -3.251,3.429; P15 -2.743,3.429; P16 -2.261,3.429; P17 -1.753,3.429; P18 -1.245,3.429; P19 -0.762,3.429; P20 -0.254,3.429; P21 0.254,3.429; P22 0.762,3.429; P23 1.245,3.429; P24 1.753,3.429; P25 2.261,3.429; P26 2.743,3.429; P27 3.251,3.429; P28 3.759,3.429; P29 4.242,3.429; P30 4.75,3.429; P31 5.258,3.429; P32 5.74,3.429; P33 6.248,3.429; P34 6.756,3.429; P35 7.239,3.429; P36 7.747,3.429; P37 8.255,3.429; P38 8.738,3.429; P39 9.246,3.429; P40 9.754,3.429
CHIPLED_0805 = smd 1.2 x 1.2: A 0,-1.05; C 0,1.05
HC49UP = smd 5.334 x 1.93: 1 -4.826,0; 2 4.826,0
SOT-23-3 = smd 0.8 x 0.976: P$1 0,1; P$2 -0.95,-1; P$3 0.95,-1
R0805 = smd 1.3 x 1.5: 1 -0.95,0; 2 0.95,0
0603-RES = smd 1.1 x 1: 1 -0.85,0; 2 0.85,0
R0603 = smd 1 x 1.1: 1 -0.85,0; 2 0.85,0
ROTSWITCH = drill 0.8 pad 1.524: P$1 4.49,-1.203; P$2 3.287,-3.287; P$3 1.203,-4.491; P$4 -1.203,-4.491; P$5 -3.287,-3.287; P$6 -4.491,-1.203; P$7 -4.49,1.203; P$8 -3.287,3.287; P$9 -1.203,4.49; P$10 1.203,4.49; P$11 3.287,3.287 | drill 0.8 pad 1.524 square: P$12 4.49,1.203 | drill 0.8 pad 2.032: P$13 0,0
SJ_2S-NO = smd 0.635 x 1.27: 1 -0.45,0; 2 0.45,0
MOLEX_67503-1020 = smd 4 x 2.05: GND1 2,8.825; GND3 2,-1.025 | smd 3.5 x 2.05: GND2 6.25,8.825; GND4 6.25,-1.025 | smd 2.25 x 0.5: P$1 6.225,5.5; P$2 6.225,4.7; P$3 6.225,3.9; P$4 6.225,3.1; P$5 6.225,2.3 | hole 0.9: 3.9,6.1; 3.9,1.7

### Placement (x,y rotation side)
B0  7.11,18.8 270 top
B1  122.94,16.26 90 top
C1  50.92,59.44 90 top
C2  50.91,63.57 270 top
C3  109.81,37.88 0 top
C4  109.81,35.59 0 top
C5  111.71,27.75 90 top
C6  123.3,32.63 270 top
C7  89.34,78.43 90 top
C8  87.2,80.93 90 top
C9  66.97,72.62 180 top
C10  119.74,42.55 270 top
C11  117.35,39.43 270 top
C12  123.68,42.52 270 top
C13  99.26,84.88 0 top
C14  99.22,82.29 0 top
C15  117.05,42.55 270 top
C16  59.65,47.08 270 top
C17  125.76,32.63 270 top
C18  46.3,50.36 180 top
C19  63.15,41.41 0 top
C20  62.35,47.89 90 top
C21  119.21,27.4 0 top
C22  126.19,42.55 270 top
C23  15.19,64.96 90 top
C24  6.18,53.22 0 top
CAN1  19.81,81.28 180 top
D1  54.4,51.07 0 top
D2  106.1,46.82 180 top
D3  20.42,63.99 0 top
D4  10.38,51.58 270 top
D5  17.78,28.45 270 top
D6  17.78,34.54 90 top
F1  10.16,46.93 270 top
F3  104.36,69.71 90 top
F4  113.34,69.76 90 top
F5  108.56,69.69 90 top
H7  69.89,44.58 180 top
IC1  61.71,60.74 270 top
IC2  41.11,57.94 90 top
IC3  32.65,58 270 top
IC4  90.36,69.56 225 top
IC5  53.73,41.9 90 top
IC6  94.88,83.6 180 top
IC7  118.98,33.08 0 top
IC8  8.24,61.32 90 top
IC9  75.85,69.84 90 top
J2  23.09,47.82 0 top
L1  75.49,62.71 90 top
L2  124.53,54.13 180 top
LCD  76.52,26.24 0 top
LCD_CONN  88.79,65.1 180 top
LED  110.24,81.79 180 top
LED2  48.69,34.92 0 top
LED3  46.46,34.93 180 top
Q1  40.52,64.22 0 top
Q2  112.8,55.13 0 top
Q3  113.25,65.34 0 top
Q4  104.08,55.18 0 top
Q5  104.29,65.47 0 top
Q6  108.43,55.21 0 top
Q7  108.5,65.37 0 top
R1  54.3,48.65 180 top
R2  69.9,37.97 90 top
R3  35.99,53.83 180 top
R6  28.79,65.6 180 top
R7  63.06,44.51 0 top
R8  51.08,34.53 90 top
R9  46.37,47.85 0 top
R10  91.55,78.38 90 top
R11  104.16,60.54 180 top
R12  103.99,50.39 180 top
R13  113.15,60.42 180 top
R14  112.72,50.33 180 top
R15  108.43,60.54 180 top
R16  108.3,50.36 180 top
R17  17.91,3.05 180 top
R18  15.62,6.48 90 top
R19  15.62,10.29 90 top
R20  16.76,14.1 0 top
R21  36.96,10.67 270 top
R22  37.72,2.67 180 top
R23  12.45,4.75 90 top
R24  12.09,8.89 90 top
R25  11.81,12.95 90 top
R26  41.53,14.86 0 top
R27  37.34,6.86 270 top
R28  77.72,3.81 270 top
R29  54.86,3.05 90 top
R30  54.86,6.86 90 top
R31  54.86,10.67 90 top
R32  73.91,12.95 0 top
R33  74.68,5.33 270 top
R34  47.62,2.29 180 top
R35  51.44,4.95 90 top
R36  51.44,9.53 90 top
R37  57.53,12.19 90 top
R38  76.58,10.29 270 top
R39  117.47,5.33 270 top
R40  93.34,3.43 90 top
R41  93.34,7.24 90 top
R42  93.34,11.05 90 top
R43  110.62,14.48 0 top
R44  113.54,6.86 270 top
R45  114.68,3.43 270 top
R46  89.15,4.95 90 top
R47  89.53,9.14 90 top
R48  96.01,13.72 180 top
R49  113.54,11.3 270 top
R50  114.84,27.74 90 top
R51  121.44,38.94 90 top
R52  111.56,30.43 0 top
R53  111.56,32.72 0 top
S1  26.9,7.18 0 top
S2  65,7.18 0 top
S3  103.1,7.18 0 top
SHIFT  64.01,81.79 180 top
SJ1  58.56,51.07 180 top
USB  2.1,27.2 0 top
VCC!  33.4,68.1 270 top

### Tracks (layer width: path | path; a pad name or v marks a point on that pad's centre or on a via)
3.3V  (via drill 0.35)
  Top 0.15: 88.65,73.05 IC4.16
  Top 0.152: IC4.18 88.34,71.94 88.77,71.94 89.06,72.24 89.06,72.64 88.65,73.05
  Top 0.203: 86.97,73.06 87.22,73.06 IC4.18 87.95,72.35
  Top 0.305: IC9.14 71.88,72.38 71.87,72.37 | 92.9,74.4 92.9,73.87 IC4.9 | 97.05,63.32 LCD_CONN.P4
  Top 0.813: C9.1 70.57,72.61 70.81,72.37 | v95.83,79.13 IC6.5 | v95.83,79.13 | 85.42,74.61 86.97,73.06 | R10.2 95.72,79.23 v95.83,79.13 | v95.83,79.13 95.83,77.33 | 95.83,77.33 92.9,74.4 | 95.83,77.33 96.05,77.33 99.33,74.05 99.33,65.6 97.05,63.32 | v85.5,79.2 85.42,79.12 85.42,74.61 | IC9.14 72.04,73.04 73.8,74.8 85.23,74.8 85.42,74.61
  Top 0.889: IC6.5 C14.1 | 70.81,72.37 71.87,72.37
  Bottom 0.813: v85.5,79.2 95.75,79.2 v95.83,79.13
5V_REG_IN
  Top 0.813: D3.C 15.3,63.99 C23.1 IC8.3
12V
  Top 0.61: Q5.P$3 106.09,64.47 106.95,65.34 108.15,65.34 109.12,64.37 Q7.P$3 110.76,64.37 111.7,65.31 112.9,65.31 113.88,64.34 Q3.P$3
  Top 0.813: C10.1 121.41,43.45 121.44,43.42 | D3.A 24.49,63.99 24.5,64 | R51.2 121.44,43.42 | C12.1 121.44,43.42 | 24.5,68.7 24.5,75.62 CAN1.P$1
  Top 0.889: C12.1 123.7,43.45 C22.1 126.2,43.44 | C10.1 C15.1
  Top 1.016: 24.5,53 24.5,64 24.5,68.7 43.4,87.6 105.6,87.6 114.14,79.06 117.35,79.06 126.19,70.21 126.19,60.99 | 24.5,53 24.5,51.56 23.09,50.15 J2.P2 | C22.1 126.19,50.29 | 126.19,50.29 126.19,60.99 | L2.P$1 123.97,50.29 126.19,50.29 | Q3.P$3 122.84,64.34 126.19,60.99 | D4.C 24.07,53.43 24.5,53
AVR_CS
  Top 0.305: IC9.2 72.62,67.99 72.62,68.23 71.45,69.4 60.91,69.4 60.73,69.22 60.73,68.71 IC1.10
AVR_MISO  (via drill 0.35)
  Top 0.305: IC1.13 58.33,68.71 58.33,69.22 59.88,70.77 73.47,70.77 73.58,70.67 v73.89,70.67 | IC9.6 78.4,67.31 78.35,67.36 v78.35,69
  Bottom 0.305: v73.89,70.67 75.17,70.67 76.69,69.15 78.2,69.15 v78.35,69
AVR_MOSI
  Top 0.305: IC1.12 59.13,68.71 59.13,69.22 60.22,70.31 73.28,70.31 73.64,69.96 74.2,69.96 74.6,70.36 74.6,70.93 74.58,70.95 IC9.12 74.58,71.65
AVR_SCLK  (via drill 0.35)
  Top 0.305: IC1.11 59.93,68.71 59.93,69.22 60.56,69.86 72.26,69.86 | 72.26,69.86 73.09,69.86 73.45,69.5 74.39,69.5 75.17,70.29 76.53,70.29 77.7,71.45 77.7,71.7 IC9.9 | 72.26,69.86 73.89,68.23 73.89,66.45 73.91,66.45 74.17,66.2 76.41,66.2 77.55,65.06 77.55,61.26 75.95,59.65 75.95,58.66 v72.43,55.15 | v69.64,51.02 69.69,50.96 H7.3
  Bottom 0.305: v72.43,55.15 69.53,52.25 69.53,51.42 69.64,51.32 v69.64,51.02
B2
  Top 0.152: LCD_CONN.P23 87.54,63.55 IC4.35
B3
  Top 0.152: LCD_CONN.P24 87.03,63.76 IC4.34
B4
  Top 0.152: LCD_CONN.P25 86.53,63.97 IC4.33
B5
  Top 0.152: LCD_CONN.P26 86.04,64.17 IC4.32
B6
  Top 0.152: LCD_CONN.P27 85.54,64.38 IC4.31
B7
  Top 0.152: LCD_CONN.P28 85.03,64.59 IC4.30
BL_ANODE
  Top 0.305: 98.04,59.94 98.03,59.95 LCD_CONN.P2
  Top 0.813: C3.2 103.95,44.63 D2.P$2 98.04,52.72 98.04,59.94
  Top 0.889: R53.1 110.71,34.37 C4.2 C3.2
  Top 1.27: 103.48,46.82 D2.P$2
CAN_0H
  Top 0.406: IC2.7 37.78,57.05 32,57.05 IC3.2 30.43,57.05 25.95,52.56 25.95,49.74 25.25,49.05 J2.P4
CAN_0L
  Top 0.406: J2.P1 24.53,50.33 25.39,51.19 25.39,52.79 IC3.1 31.64,58.85 35.69,58.85 35.96,58.58 IC2.6
CAN_1H  (via drill 0.35)
  Top 0.813: v20.51,72.39 21.31,73.19 CAN1.P$2
  Bottom 0.508: v20.51,72.39 20.51,50.79 J2.P3
CAN_1L  (via drill 0.35)
  Top 0.813: v18.99,72.36 18.31,73.03 CAN1.P$3
  Bottom 0.508: v18.99,72.36 18.99,50.24 J2.P7
D_N
  Top 0.366: 8.47,31.76 arc-90 USB.P$2 8.47,31.76 | 8.47,31.76 53.24,31.76 54.6,33.13 54.6,43.58 52.73,45.46 50.12,45.46 IC5.16 | D6.1 17.78,31.76 8.47,31.76
D_P
  Top 0.366: USB.P$3 arc-90 8.47,31.24 17.78,31.24 | 17.78,31.24 53.45,31.24 55.12,32.91 55.12,43.8 52.79,46.12 IC5.15 | D5.1 17.78,31.24
DATA_EN
  Top 0.152: LCD_CONN.P34 82.03,65.12 IC4.25
DCLK
  Top 0.152: LCD_CONN.P30 84.04,64.32 IC4.29
DISP_EN
  Top 0.152: LCD_CONN.P31 83.53,64.5 IC4.28
DOWN_SH  (via drill 0.35)
  Top 0.61: v66.04,84.84 68.07,82.8 68.07,76.75 SHIFT.P$1
  Bottom 0.61: v66.04,84.84 65.53,85.34 37.08,85.34 36.58,84.84 36.54,84.84 21.3,69.6 21.3,55.7 26.29,50.71 26.29,47.24 24.96,45.91 24.12,45.91 J2.P11
DRV1
  Top 0.813: F4.2 114.74,72.56 LED.P$1
DRV2
  Top 0.813: F5.2 111.74,74.27 LED.P$2
DRV3
  Top 0.813: LED.P$3 108.74,75.49 F3.2
DTR
  Top 0.254: IC5.2 64.24,38.32 65.55,39.64 65.55,42.34 65,42.89 63.68,42.89 63.04,43.53 63.04,45.37 62.35,46.06 C20.1
FT801_CS_N  (via drill 0.35)
  Top 0.254: IC4.6 93.19,71.99 93.7,72.5 93.7,73.25 v93.56,73.39
  Top 0.305: v77.37,69.83 76.72,69.83 75.9,69.83 74.58,68.51 IC9.3
  Bottom 0.305: v93.56,73.39 93.07,73.88 87.76,73.88 86.14,72.26 86.14,71.68 84.29,69.83 v77.37,69.83
FT801_MISO  (via drill 0.35)
  Top 0.254: IC4.4 93.89,71.29 95,72.4 v95.23,72.4
  Top 0.305: IC9.5 77.12,66.76 77.8,66.07 80.43,66.07 v80.47,66.11
  Bottom 0.305: v80.47,66.11 80.47,65.53 81.7,64.3 92.1,64.3 95.9,68.1 95.9,71.73 v95.23,72.4
FT801_MOSI  (via drill 0.35)
  Top 0.254: 93.53,71.63 IC4.5 93.53,71.63 | 94.51,72.96 94.51,72.61 93.53,71.63
  Top 0.305: v94.92,74.72 94.51,74.31 94.51,72.96 | IC9.11 75.85,70.98 v75.83,70.97
  Bottom 0.305: v94.92,74.72 94.53,74.34 87.57,74.34 85.68,72.45 85.68,71.87 84.81,71 75.86,71 v75.83,70.97
FT801_SCLK  (via drill 0.35)
  Top 0.254: 95.51,71.72 94.99,71.72 IC4.3
  Top 0.305: v80.95,73.82 80.95,73.68 IC9.8 | 95.51,71.72 95.91,72.12 95.91,74.02 v96.62,74.72
  Bottom 0.305: v96.62,74.72 95.88,74.72 95.2,75.41 93.96,75.41 93.35,74.8 81.93,74.8 v80.95,73.82
G2
  Top 0.152: LCD_CONN.P15 91.53,62.57 93.28,64.31 93.28,65.48 93.28,65.49 93.28,66.28 IC4.42
G3
  Top 0.152: LCD_CONN.P16 91.05,62.52 92.97,64.44 92.97,65.88 IC4.41
G4
  Top 0.152: 92.48,64.66 | LCD_CONN.P17 90.54,62.47 92.48,64.41 92.48,64.66 | IC4.40 92.49,65.67 92.49,65.16 92.48,65.14 92.48,64.66
G5
  Top 0.152: 91.86,64.22 | LCD_CONN.P18 90.03,62.39 91.86,64.22 | IC4.39 92.17,65.27 92.17,64.53 91.86,64.22
G6
  Top 0.152: IC4.38 91.87,64.85 91.87,64.66 91.56,64.35 91.46,64.25 90.69,64.25 89.85,63.42 | 89.85,63.42 89.78,63.34 | LCD_CONN.P19 89.55,63.12 89.85,63.42
G7
  Top 0.152: LCD_CONN.P20 89.04,63.04 IC4.37
GND  (via drill 0.3, 0.35, 0.5, 0.6, 0.7, 6.35 pad 6.35)
  Top 0.15: IC4.15 89.02,73.36
  Top 0.152: 88.03,60.42 88,60.4 | 88.5,61.64 LCD_CONN.P21
  Top 0.203: 87.16,69.56 IC4.23
  Top 0.254: 93.31,69.47 IC4.2 | IC4.36 90.31,65.69 90.31,66.64 IC4.V_3 | LCD_CONN.P22 88.03,60.42 | 88.5,61.64 88.5,60.4 88.05,60.4 88.03,60.42 | C9.2 64.31,72.61 v64.3,72.6 | IC1.63 69.23,66.18 68.76,66.18 68.7,66.23 v67.81,66.23 | IC9.1 70.81,67.3 v69.99,68.13 | LCD_CONN.P36 81.04,59.56 v81.1,59.5 | LCD_CONN.P29 84.55,60.35 84.8,60.1 v84.8,60 | 88.03,60.42 88.03,59.83 v88,59.8 | 96.5,59.66 v96.58,59.58 | LCD_CONN.P6 LCD_CONN.P5 96.53,59.63 v96.58,59.58 | LCD_CONN.P3 97.53,60.52 v96.58,59.58 | LCD_CONN.P14 92.04,60.14 v91.9,60 92.55,60.65 LCD_CONN.P13 | IC3.3 v35.5,58 | R3.2 35.03,52.03 v35,52
  Top 0.305: 90.59,72.22 IC4.10 | IC4.13 90.21,73.54 90.13,72.24 89.02,73.36 | v99.21,63.78 98.54,63.11 LCD_CONN.P1
  Top 0.406: IC5.21 51.78,42.22 | IC7.4 IC7.5 IC7.6 IC7.7 IC7.8 116.58,30.22 v116.33,29.97 | IC7.15 IC7.16 121.41,34.86 v121.41,36.07 | IC9.13 73.94,73.02 73.94,73.33 74.15,73.54 74.4,73.54 v74.68,73.82
  Top 0.508: 51.78,42.22 v52.71,41.29 | IC1.22 55.66,62.74 v56.1,62.3 | IC6.2 94.88,86.32 v94.8,86.4 | C13.2 101.72,84.88 v101.8,84.8 | C8.2 85.47,81.83 v85.4,81.9 | C7.2 89.34,80.76 v89.3,80.8 | IC4.EP 90.59,69.8 90.59,72.22
  Top 0.61: 90.13,72.24 IC4.EP | IC4.EP 87.16,69.56 | C3.1 107.95,37.88 107.93,37.9 107.83,37.8 v107.63,37.8 | IC2.2 43.29,57.31 v47.3,57.3 | C16.2 59.6,46.13 v59.6,45 | IC5.7 58.77,41.57 59,41.8 59,41.9 v59.1,42 | IC5.18 51.96,44.17 v52.1,44.31 | IC5.26 IC5.25 52.01,39.62 v52.11,39.52 | C18.2 45.35,51.95 v45.15,52.16 | C2.1 49.7,65.73 v49.7,66 | IC9.10 77.12,73.85 v77.1,73.86 | R27.2 37.45,5.9 v39.1,5.9 | C12.2 123.68,40.45 v123.73,40.4 | C24.2 8.68,53.22 v8.7,53.2 | IC8.1 10.8,58.68 v10.8,57.3 | C23.2 15.19,67.1 v15.39,67.3 | v36.2,68.25 36.05,68.1 VCC!.C | v61.24,50.95 59.12,50.95 SJ1.1 | v68.34,43.6 67.35,42.61 H7.6 | USB.GND3 USB.GND4 11.78,26.18 11.8,26.2 v11.9,26.2 | USB.GND1 USB.GND2 8.38,36.05 v12.16,36.05 | USB.P$5 11.7,29.5 v11.8,29.4 | Q4.P$3 105.88,53.34 v106.17,53.34 | Q6.P$3 110.65,52.93 v110.74,52.93 | Q2.P$3 114.54,53.34 v115.32,53.34 | C15.2 v115.32,41.65 v115.32,41.66 | C10.2 119.74,40.28 v119.89,40.13 | C11.2 117.35,37.78 v117.94,37.2 | C17.2 125.76,30.7 v125.98,30.48 | C6.2 123.3,30.12 v123.44,29.97 | C21.2 120.4,27.68 v120.4,28.96 | C5.2 110.04,28.65 v109.73,28.96 | R52.1 110.67,30.48 v108.71,30.48 | C4.1 107.22,35.59 v107.19,35.56 | SHIFT.P$3 62.48,76.34 v62.48,80.26 | R49.2 114.55,9.4 v116.33,9.65 | B0.P$2 14.25,17.3 v14.73,17.78 | B1.P$2 118.62,19.56 v117.86,20.32 | D6.2 v17.78,37.08 | D5.2 v17.78,25.4 | v68,57.9 68.04,57.94 IC1.53 | v62.97,39.47 64.1,40.61 C19.2 | v48.77,58.93 49.21,58.49 C1.1 | v126.28,39.94 126.19,40.03 C22.2 | R38.2 76.59,9.43 v79.46,9.43 | IC4.EP IC4.V_7 | IC4.EP 90.46,69.47 93.31,69.47 | IC9.4 75.98,67.43 v75.98,68.82
  Top 0.813: CAN1.P$4 15.24,75.74 | 15.24,75.74 15.24,75.18 | 15.24,75.74 v15.24,78.74 | LED.P$4 105.74,79.32 v106.17,79.76 | C14.2 v100.08,80.77
  Top 1.016: D4.A 10.38,48.26 F1.1 8.97,48.03 v8,49
  other vias: 14.73,87.38 18.29,87.38 21.59,87.38 24.89,87.38 80.75,68.53 96.79,72.27 96.75,73.26 7,84 7,7 123,7 123,84
  pour Route6 (rank 6): -40.8,38.62 -40.8,89.77 -26.38,104.19 150.98,104.19 159.91,95.26 159.5,28 159.5,25 111.5,25 111.5,22.03 159.91,22.03 160.06,-16.32 -29.92,-17.32 -41.54,-5.7 -41.54,38.72 -40.82,39.44
GND_UF
  Top 0.508: J2.P10 20.53,45.83 F1.2
HSYNC
  Top 0.152: LCD_CONN.P32 83.05,64.73 IC4.27
INT_N  (via drill 0.35)
  Top 0.305: v61.32,66.43 IC1.9 | IC4.11 92,74.4 92,75.23 v91.59,75.64
  Bottom 0.305: v61.32,66.43 66.33,66.43 76.2,76.3 90.93,76.3 v91.59,75.64
M8RXD
  Top 0.305: IC5.1 58.02,37.02 R2.1
M8TXD
  Top 0.305: IC5.5 58.59,40.27 62.11,43.79 R7.1
N$2
  Top 0.254: IC4.17 87.2,73.8 C8.1
N$3
  Top 0.254: IC4.12 90.99,74.11 89.3,75.8 89.3,77.55 C7.1
  Top 0.305: C7.1 91.49,77.58 R10.1
N$4
  Top 0.305: R50.1 112.74,26.84 C5.1
N$6
  Top 0.254: IC2.8 36.94,54.94 R3.1
N$9
  Top 0.254: R6.1 32.24,68.1 VCC!.A
N$11
  Top 0.305: 35.66,64.25 Q1.1
  Top 0.406: IC1.24 53.18,61.13 52.43,60.39 C1.2 50.04,60.39 49.12,61.31 41.34,61.31 40.55,62.1 40.55,63.24 39.56,64.22 Q1.1
N$22
  Top 0.305: L1.2 73.5,66.2 71.63,66.2 71.09,66.74 IC1.64
N$27
  Top 0.813: Q4.P$2 103.14,50.4 R12.2
N$28
  Top 0.813: Q5.P$2 103.34,60.57 R11.2
N$29
  Top 0.813: R11.1 105.01,57.11 Q4.P$1
N$30
  Top 0.813: F3.1 104.36,66.54 Q5.P$1
N$31
  Top 0.813: Q2.P$2 111.85,50.35 R14.2
N$32
  Top 0.305: IC5.23 49.41,40.92 49.05,40.57 49.05,40.55 48.7,40.2 LED2.C
N$33
  Top 0.813: Q3.P$2 R13.2
N$34
  Top 0.305: IC5.22 49.07,41.57 47.6,40.1 47.6,35.02 LED3.C
N$35
  Top 0.305: LED2.A 50.96,33.87 R8.1
N$36  (via drill 0.35)
  Top 0.305: R9.1 45.41,43.78 v45.5,43.7 | v45.5,37.6 45.5,36.93 LED3.A
  Bottom 0.305: v45.5,43.7 v45.5,37.6
N$37
  Top 0.813: R13.1 114,57.34 Q2.P$1
N$38
  Top 0.813: F4.1 113.34,66.43 Q3.P$1
N$39
  Top 0.813: Q6.P$2 107.48,50.59 R16.2
N$40
  Top 0.813: Q7.P$2 107.56,60.57 R15.2
N$41
  Top 0.813: R15.1 109.28,57.06 Q6.P$1
N$42
  Top 0.813: F5.1 108.56,66.42 Q7.P$1
N$43  (via drill 0.35)
  Top 0.305: R17.1 19.05,3.34
  Top 0.508: R22.2 31.31,2.67 S1.P$2 | 19.05,3.34 v19.05,4.57
  Bottom 0.305: v19.05,4.57 22.78,4.57 23.17,4.96 29.12,4.96 S1.P$2
N$44
  Top 0.305: S1.P$3 27.06,1.17 18.94,1.17 R17.2
  Top 0.508: R17.2 16.2,3.9 R23.1
N$45
  Top 0.305: R18.1 15.76,5.64 16.3,5.71
  Top 0.508: 16.3,5.71 19.43,5.71 21.8,2.59 S1.P$4 | 15.72,5.6 15.76,5.64 | R18.1 12.47,5.63 R23.2
N$46
  Top 0.305: S1.P$5 22.88,3.79 | 15.71,7.24 R18.2
  Top 0.508: 22.88,3.79 19.43,7.24 15.71,7.24 | R18.2 12.8,7.33 R24.1
N$47
  Top 0.305: 15.62,13.8 R20.1 16.13,14.1
  Top 0.508: R25.2 15.62,13.8 | 16.13,14.1 17.37,12.48 21.12,12.48 S1.P$8
N$48
  Top 0.305: S1.P$9 26.05,11.57 | 40.3,14.48 R26.1
  Top 0.508: S1.P$9 23.17,14.1 R20.2 | 26.05,11.57 28.96,14.48 40.3,14.48
N$49
  Top 0.508: S1.P$6 18.85,9.44 R19.1 15.32,9.74 R24.2
N$50
  Top 0.508: S1.P$7 19.56,11.14 R19.2 12.78,11.14 R25.1
N$51
  Top 0.305: 36.91,11.57 R21.1 37.05,11.43
  Top 0.508: 36.91,11.57 S1.P$10 | 37.05,11.43 40.39,11.43 42.38,13.42 R26.2
N$52
  Top 0.305: S2.P$2 68.98,4.48 | R33.2 74.85,4.66
  Top 0.508: 68.98,4.48 R33.2 | 74.85,4.66 R28.1
N$53
  Top 0.305: R27.1 36.96,8.09
  Top 0.508: S1.P$11 30.74,9.82 R21.2 36.96,8.09
N$54
  Top 0.305: R34.1 49.15,2.29 50.27,1.17 64.78,1.17 S2.P$3
  Top 0.508: R28.2 76.67,1.91 66.89,1.91 S2.P$3
N$55
  Top 0.305: 63.41,2.2 S2.P$4 | R34.2 46.77,2.58 | 54.78,2.29 R29.1
  Top 0.508: R29.1 63.41,2.2 | 46.77,2.58 48.01,3.81 49.15,3.81 50.67,2.29 54.78,2.29
N$56
  Top 0.305: 54.66,4.1 R29.2 | 61.61,3.9 S2.P$5
  Top 0.508: R35.1 54.66,4.1 | R29.2 61.61,3.9
N$57
  Top 0.305: 61.16,9.82 S2.P$8 | 51.99,9.82 R36.2
  Top 0.508: 61.16,9.82 R31.1 51.99,9.82
N$58
  Top 0.305: 63.59,11.78 S2.P$9
  Top 0.508: R31.2 55.04,11.34 R37.1 60.11,11.34 60.58,11.81 63.56,11.81 63.59,11.78
N$59
  Top 0.305: 60.38,6.01 S2.P$6 | 54.66,5.8 R30.1
  Top 0.508: R30.1 60.38,6.01 | R35.2 54.66,5.8
N$60
  Top 0.305: R36.1 51.52,8.68 | 54.78,7.62 R30.2 | 59.94,7.71 S2.P$7
  Top 0.508: 51.52,8.68 52.58,7.62 54.78,7.62 | R30.2 59.94,7.71
N$61
  Top 0.305: S2.P$10 66.83,12.19
  Top 0.508: R32.1 72.3,12.19 66.83,12.19 | R37.2 57.62,12.95 64.39,12.95 65.77,11.57 S2.P$10
N$62
  Top 0.508: S2.P$11 69.06,11.14 R38.1 R32.2
N$63
  Top 0.152: 113.71,6.18 R44.2 113.45,6.1
  Top 0.508: 113.71,6.18 R39.1 | S3.P$2 107.81,3.79 110.11,6.1 113.45,6.1
N$64
  Top 0.152: 114.89,4.48 R45.1 114.39,4.57
  Top 0.508: R39.2 114.89,4.48 | S3.P$3 109.27,2.59 111.25,4.57 114.39,4.57
N$65
  Top 0.152: 101.9,2.06 101.9,2.59 S3.P$4
  Top 0.305: R40.1 101.89,2.58 101.9,2.59
  Top 0.508: R45.2 113.81,1.47 102.87,1.47 101.9,2.06
N$66
  Top 0.305: 93.83,3.79 R40.2 | 89.33,4.28 R46.1
  Top 0.508: S3.P$5 93.83,3.79 | R40.2 89.33,4.28
N$67
  Top 0.305: 93.51,10.37 R42.1 | 89.74,10.2 R47.2
  Top 0.508: S3.P$8 93.51,10.37 | R42.1 89.74,10.2
N$68
  Top 0.152: S3.P$9 101.57,11.9
  Top 0.508: 98.68,11.9 R42.2 | 98.68,11.9 101.57,11.9 | R48.1 98.68,11.9
N$69
  Top 0.305: S3.P$6 98.1,6.39 | R41.1 92.76,5.8
  Top 0.508: 98.1,6.39 R41.1 | 92.76,5.8 R46.2
N$70
  Top 0.305: 93.14,8.29 R41.2 | 98.42,8.09 S3.P$7
  Top 0.508: R47.1 93.14,8.29 | R41.2 98.42,8.09
N$71
  Top 0.305: S3.P$10 104.47,11.74
  Top 0.508: 104.47,11.74 107.21,14.48 R43.1 | R48.2 96.31,14.86 101.01,14.86 S3.P$10
N$72
  Top 0.508: R49.1 112.23,14.48 R43.2 108.37,10.37 S3.P$11
N$75
  Top 0.305: 114.76,28.72 R50.2 117.07,28.64 C21.1 118.31,31.78 118.17,31.93 118.17,33.59 116.94,34.83 IC7.1
N$77
  Top 0.305: 117.8,40.33 C11.1 119.52,38.16 121.38,38.16 R51.1 120.6,37.25 120.6,33.74 120.95,33.4 121.31,33.4 IC7.13
N$79
  Top 0.254: L2.P$2 116.93,44.76 114.66,42.49 114.66,41.38 116.33,39.71 116.33,37.05 120.96,32.42 121.28,32.42 IC7.11 IC7.10 IC7.9
  Top 0.305: D2.P$1 107.58,46.82
  Top 0.406: L2.P$2 113.77,46.82 D2.P$1
N$82
  Top 0.254: IC7.2 114.02,34.33 R53.2
  Top 0.305: R53.2 R52.2
N$85
  Top 0.254: IC7.14 123,33.83 C6.1
N$87
  Top 0.152: C17.1 124.62,33.53 123.99,32.9 121.46,32.9 IC7.12
PB5(PWM)  (via drill 0.35)
  Top 0.406: v61.3,64.2 57.95,67.55 56.88,67.55 56.68,67.75 56.68,68.33 IC1.15 | v104.9,52.3 104.9,50.45 R12.1
  Bottom 0.406: v61.3,64.2 80.29,64.2 81.36,63.13 94.07,63.13 v104.9,52.3
PB6(PWM)  (via drill 0.35)
  Top 0.406: R16.1 109.15,52.05 v109.1,52.1 | v58.5,65.5 57.01,66.99 56.64,66.99 55.71,67.92 IC1.16
  Bottom 0.406: v109.1,52.1 97.51,63.69 81.59,63.69 79.78,65.5 v58.5,65.5
PB7(PWM)  (via drill 0.35)
  Top 0.406: IC1.17 55.76,66.74 v59.8,62.7 | v113.6,52.2 113.6,50.36 R14.1
  Bottom 0.406: v59.8,62.7 81,62.7 92.33,51.37 109.4,51.37 110.24,52.2 v113.6,52.2
PC0  (via drill 0.35)
  Top 0.305: IC1.35 57.31,54.96 v55.88,55.88
  Bottom 0.305: B0.P$1 21.82,20.3 22.86,21.34 22.86,33.02 45.72,55.88 v55.88,55.88
PC1  (via drill 0.35)
  Top 0.305: IC1.36 58.11,56.19 v56.9,56.9 | v21.84,23.37 26.42,18.8 114.81,18.8 118.62,14.99 B1.P$1
  Bottom 0.305: v56.9,56.9 45.72,56.9 21.84,33.02 v21.84,23.37
PF0  (via drill 0.35)
  Top 0.508: IC1.61 68.34,64.34 68,64 v68,60.7
  Bottom 0.508: v68,60.7 59.85,52.55 53.52,52.55 52.89,53.19 44.68,53.19 26.9,35.41 S1.P$13
PF1  (via drill 0.35)
  Top 0.508: IC1.60 70.76,63.54 v73.1,61.2
  Bottom 0.508: S3.P$13 103.1,16 107.85,20.75 112.97,20.75 114.66,22.43 114.66,24.81 112.97,26.49 107.81,26.49 v73.1,61.2
PF2  (via drill 0.35)
  Top 0.508: v71.8,59.8 70.47,61.12 70.47,62.39 70.24,62.62 69.58,62.62 IC1.59
  Bottom 0.508: v71.8,59.8 68.21,59.8 60.1,51.69 54.08,51.69 54.07,51.7 45.8,51.7 30.9,36.8 30.9,23.23 33.38,20.75 34.3,20.75 34.35,20.71 34.85,20.75 56.37,20.75 64.97,12.15 64.97,7.21 S2.P$13
R2
  Top 0.152: LCD_CONN.P7 95.54,68.26 IC4.48
R3
  Top 0.152: LCD_CONN.P8 95.03,68.08 IC4.47
R4
  Top 0.152: LCD_CONN.P9 94.53,63.84 94.61,63.92 94.61,67.79 IC4.46
R5
  Top 0.152: LCD_CONN.P10 94.05,63.79 94.27,64.02 94.27,67.42 IC4.45
R6
  Top 0.152: LCD_CONN.P11 93.54,63.71 93.91,64.09 93.91,67.09 IC4.44
R7
  Top 0.152: LCD_CONN.P12 93.03,63.64 93.58,64.19 93.58,66.7 IC4.43
RESET  (via drill 0.35)
  Top 0.508: D1.A 56.25,49.65 | 56.25,49.65 R1.1 | D1.A SJ1.2 | SJ1.2 | 56.25,49.65 57.92,47.98 C16.1 60.51,48.84 C20.2 66.14,48.84 H7.5 | IC1.20 56.57,64.34 57.09,63.83 57.09,63.82 58.93,61.98 v58.93,57.91 | v53.85,53.34 54.36,52.83 54.36,51.82 55.11,51.07 D1.A
  Bottom 0.508: v58.93,57.91 58.93,56.39 55.88,53.34 v53.85,53.34
RX
  Top 0.254: H7.4 69.69,42.45 73.63,46.39 73.63,49.27 67.13,55.77
  Top 0.305: IC1.2 67.13,68.28 67.13,55.77 | 69.88,41.75 70.12,41.77 | 69.88,41.75 H7.4 | R2.2 69.88,38.94 69.88,41.75
RXCAN
  Top 0.254: IC2.4 43.61,59.27 43.14,59.27 42.71,58.84 42.71,55.77 43.05,55.43 45.32,55.43 45.43,55.54 IC1.31
TX
  Top 0.305: IC1.3 66.33,68.28 66.33,55.93 72.23,50.03 H7.1 68.91,44.51 R7.2
TXCAN
  Top 0.254: IC1.30 44.49,56.34 IC2.1
UP_SH  (via drill 0.35)
  Top 0.61: v65.53,82.8 65.51,82.78 SHIFT.P$2
  Bottom 0.61: v65.53,82.8 64.01,84.33 37.59,84.33 23.09,69.83 23.09,54.99 27.05,51.03 27.05,46.92 24.69,44.56 23.38,44.56 22.77,45.17 22.77,45.2 J2.P$12
VCC  (via drill 0.35)  (1 unrouted)
  Top 0.254: IC5.19 IC5.20
  Top 0.366: R8.2 52.24,35.48 v52.83,36.07 | IC5.4 59.94,39.62 v60.45,40.13 61.73,41.41 C19.1 | D1.C 52.4,50.91 v50.8,50.91
  Top 0.406: IC5.20 v52.72,42.87
  Top 0.508: R33.1 74.37,5.88 | 53.23,48.53 R1.2 53.35,50.27 D1.C | IC1.21 53.99,63.5 54.75,63.5 v56.3,63.5 | R9.2 47.31,46.81 v46.5,46
  Top 0.61: IC1.52 71.34,57.14 | v10.7,33.8 9.6,32.7 USB.P$1
  Top 0.813: v5.3,49 5.33,49.03 C24.1 5.34,53.24 IC8.4 10.9,61.32 IC8.2 13.84,61.56 v13.9,61.5 | H7.2 73.57,41.73 v74.1,41.2 | R6.2 27.84,63.24 v27.8,63.2 | IC2.3 43.42,58.58 v46.5,58.5 | 47.31,45.72 47.3,45.7 | R22.1 38.57,3.43 38,4 33.37,4 S1.P$1 | S2.P$1 74.47,5.98 R33.1 | R44.1 109.32,7.71 S3.P$1 | 71.34,57.14 71.44,57.14 v73.6,59.3 75.49,61.19 L1.1 | v97,86.4 97,84.9 | IC6.3 94.02,84.81 94.02,84.05 94.36,83.71 95.39,83.71 95.73,84.05 95.73,84.81 IC6.1 97,84.9 | 97,84.9 98.39,84.9 C13.1
  Top 0.889: 27.91,65.69 R6.2
  pour Route11 (rank 6): -39.94,40.18 -39.94,90.69 -26.21,104.12 151.1,104.12 159.8,95.42 160,25.5 109.5,25.5 109.5,21.8 159.8,21.8 160.16,-16.84 -28.95,-16.84 -40.75,-5.04 -40.75,39.63 -40.06,40.32
VCC3O
  Top 0.305: C18.1 48.3,49.31 48.3,45.17 48.65,44.82 IC5.17
  Top 0.366: 47.25,49.8 C18.1
VSYNC
  Top 0.152: LCD_CONN.P33 82.54,64.94 IC4.26
XTAL1
  Top 0.406: IC1.23 53.05,61.95 52.38,62.62 C2.2 50.01,62.62 49.25,61.87 48.89,61.87 | Q1.2 42.24,64.22 41.23,63.21 41.23,62.31 41.67,61.87 48.89,61.87 | 48.89,61.87

### Text on the board
tNames: N. Luong, A. Painter, N. Mah / J. Singh, D. Zusalim, E. Sernas / A. Delgado, D. Baron, T. Willson | DASHBOARD Rev. 5 - 2018